# Altium project ROGO_ALFA_FULL_V2I1.PrjPcb
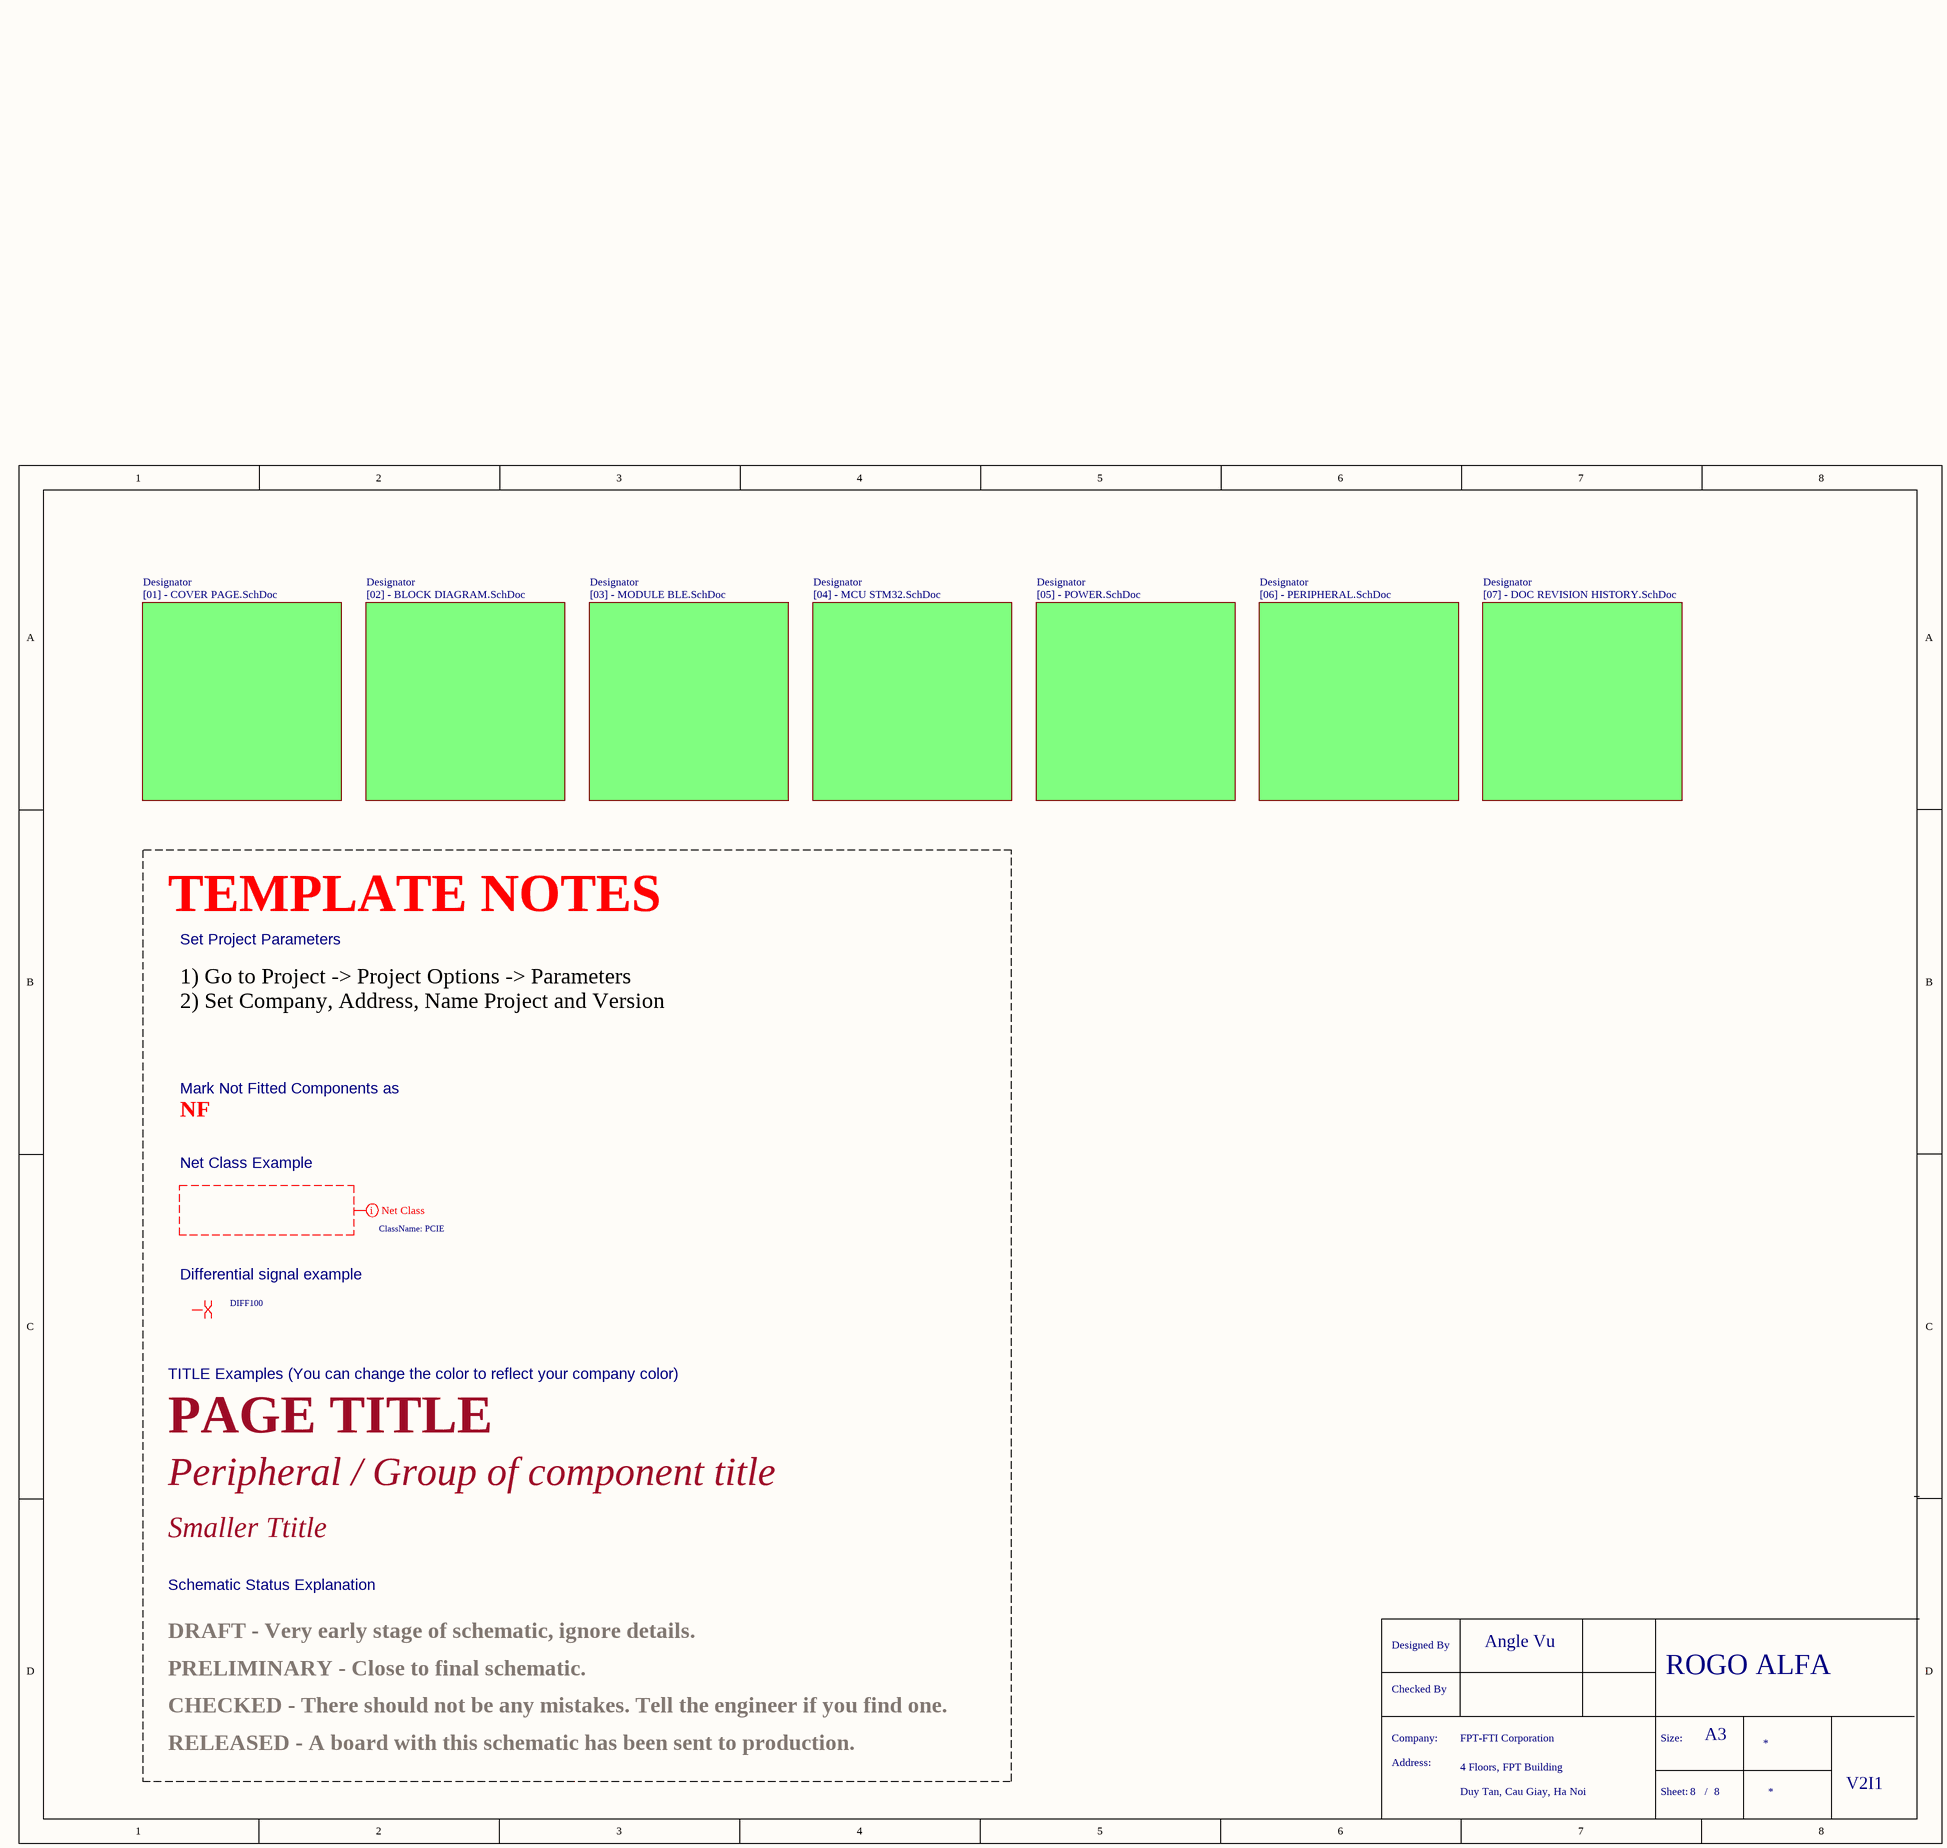
[diagram p0: ROGO ALFA FULL V2I1 Project.SchDoc]
addressName1: 4 Floors, FPT Building; addressName2: Duy Tan, Cau Giay, Ha Noi; CName: FPT-FTI Corporation; NameProject: ROGO ALFA; Version: V2I1
8 sheets, 61 parts. Net scope: flat (ports and power ports of the same name join across sheets).
Board file: ROGO_ALFA_FULL_PCB_V2I1 .PcbDoc
Sheets:
  ROGO ALFA FULL V2I1 Project.SchDoc
    Designator = [01] - COVER PAGE.SchDoc
    Designator = [02] - BLOCK DIAGRAM.SchDoc
    Designator = [03] - MODULE BLE.SchDoc
    Designator = [04] - MCU STM32.SchDoc
    Designator = [05] - POWER.SchDoc
    Designator = [06] - PERIPHERAL.SchDoc
    Designator = [07] - DOC REVISION HISTORY.SchDoc

## Sheet ROGO ALFA FULL V2I1 Project.SchDoc
size A3; CompanyName: KDS; Organization: KDS; DocumentNumber: 8; Revision: V1I1; SheetNumber: 8; SheetTotal: 8; PageSetup: Record=PageOptions|CenterHorizontal=True|CenterVertical=True|PrintScale=1.07|XCorrection=1.00|YCorrection=1.00|PrintKind=1|BorderSize=5000000|LeftOffset=0|BottomOffset=0|Orientation=2|PaperLength=1000|PaperWidth=1000|Scale=100|PaperSource=7|PrintQuality=600|MediaType=1|DitherType=10|PaperKind=A3|PrintScaleMode=1; NameAuthor: Angle Vu; ProjectName: KDS C6A816x Module

### Sub-sheets
Designator = [01] - COVER PAGE.SchDoc: no entries
Designator = [02] - BLOCK DIAGRAM.SchDoc: no entries
Designator = [03] - MODULE BLE.SchDoc: no entries
Designator = [04] - MCU STM32.SchDoc: no entries
Designator = [05] - POWER.SchDoc: no entries
Designator = [06] - PERIPHERAL.SchDoc: no entries
Designator = [07] - DOC REVISION HISTORY.SchDoc: no entries

### Layout directives
net class PCIE: (no net found under the mark)
differential pair; net class DIFF100: (no net found under the mark)

### Notes on the sheet
- TEMPLATE NOTES
- Set Project Parameters
- 1) Go to Project -> Project Options -> Parameters
  2) Set Company, Address, Name Project and Version
- NF
- Mark Not Fitted Components as
- Net Class Example
- Differential signal example
- TITLE Examples (You can change the color to reflect your company color)
- PAGE TITLE
- Peripheral / Group of component title
- Smaller Ttitle
- Schematic Status Explanation
- PRELIMINARY - Close to final schematic.
- DRAFT - Very early stage of schematic, ignore details.
- CHECKED - There should not be any mistakes. Tell the engineer if you find one.
- RELEASED - A board with this schematic has been sent to production.
- Designed By
- Checked By
- Company:
- Size:
- A3
- Address:
- Sheet:
- /

## Sheet [01] - COVER PAGE.SchDoc
size A3; DocumentNumber: 1; SheetNumber: 1; SheetTotal: 8; NameAuthor: Angle Vu
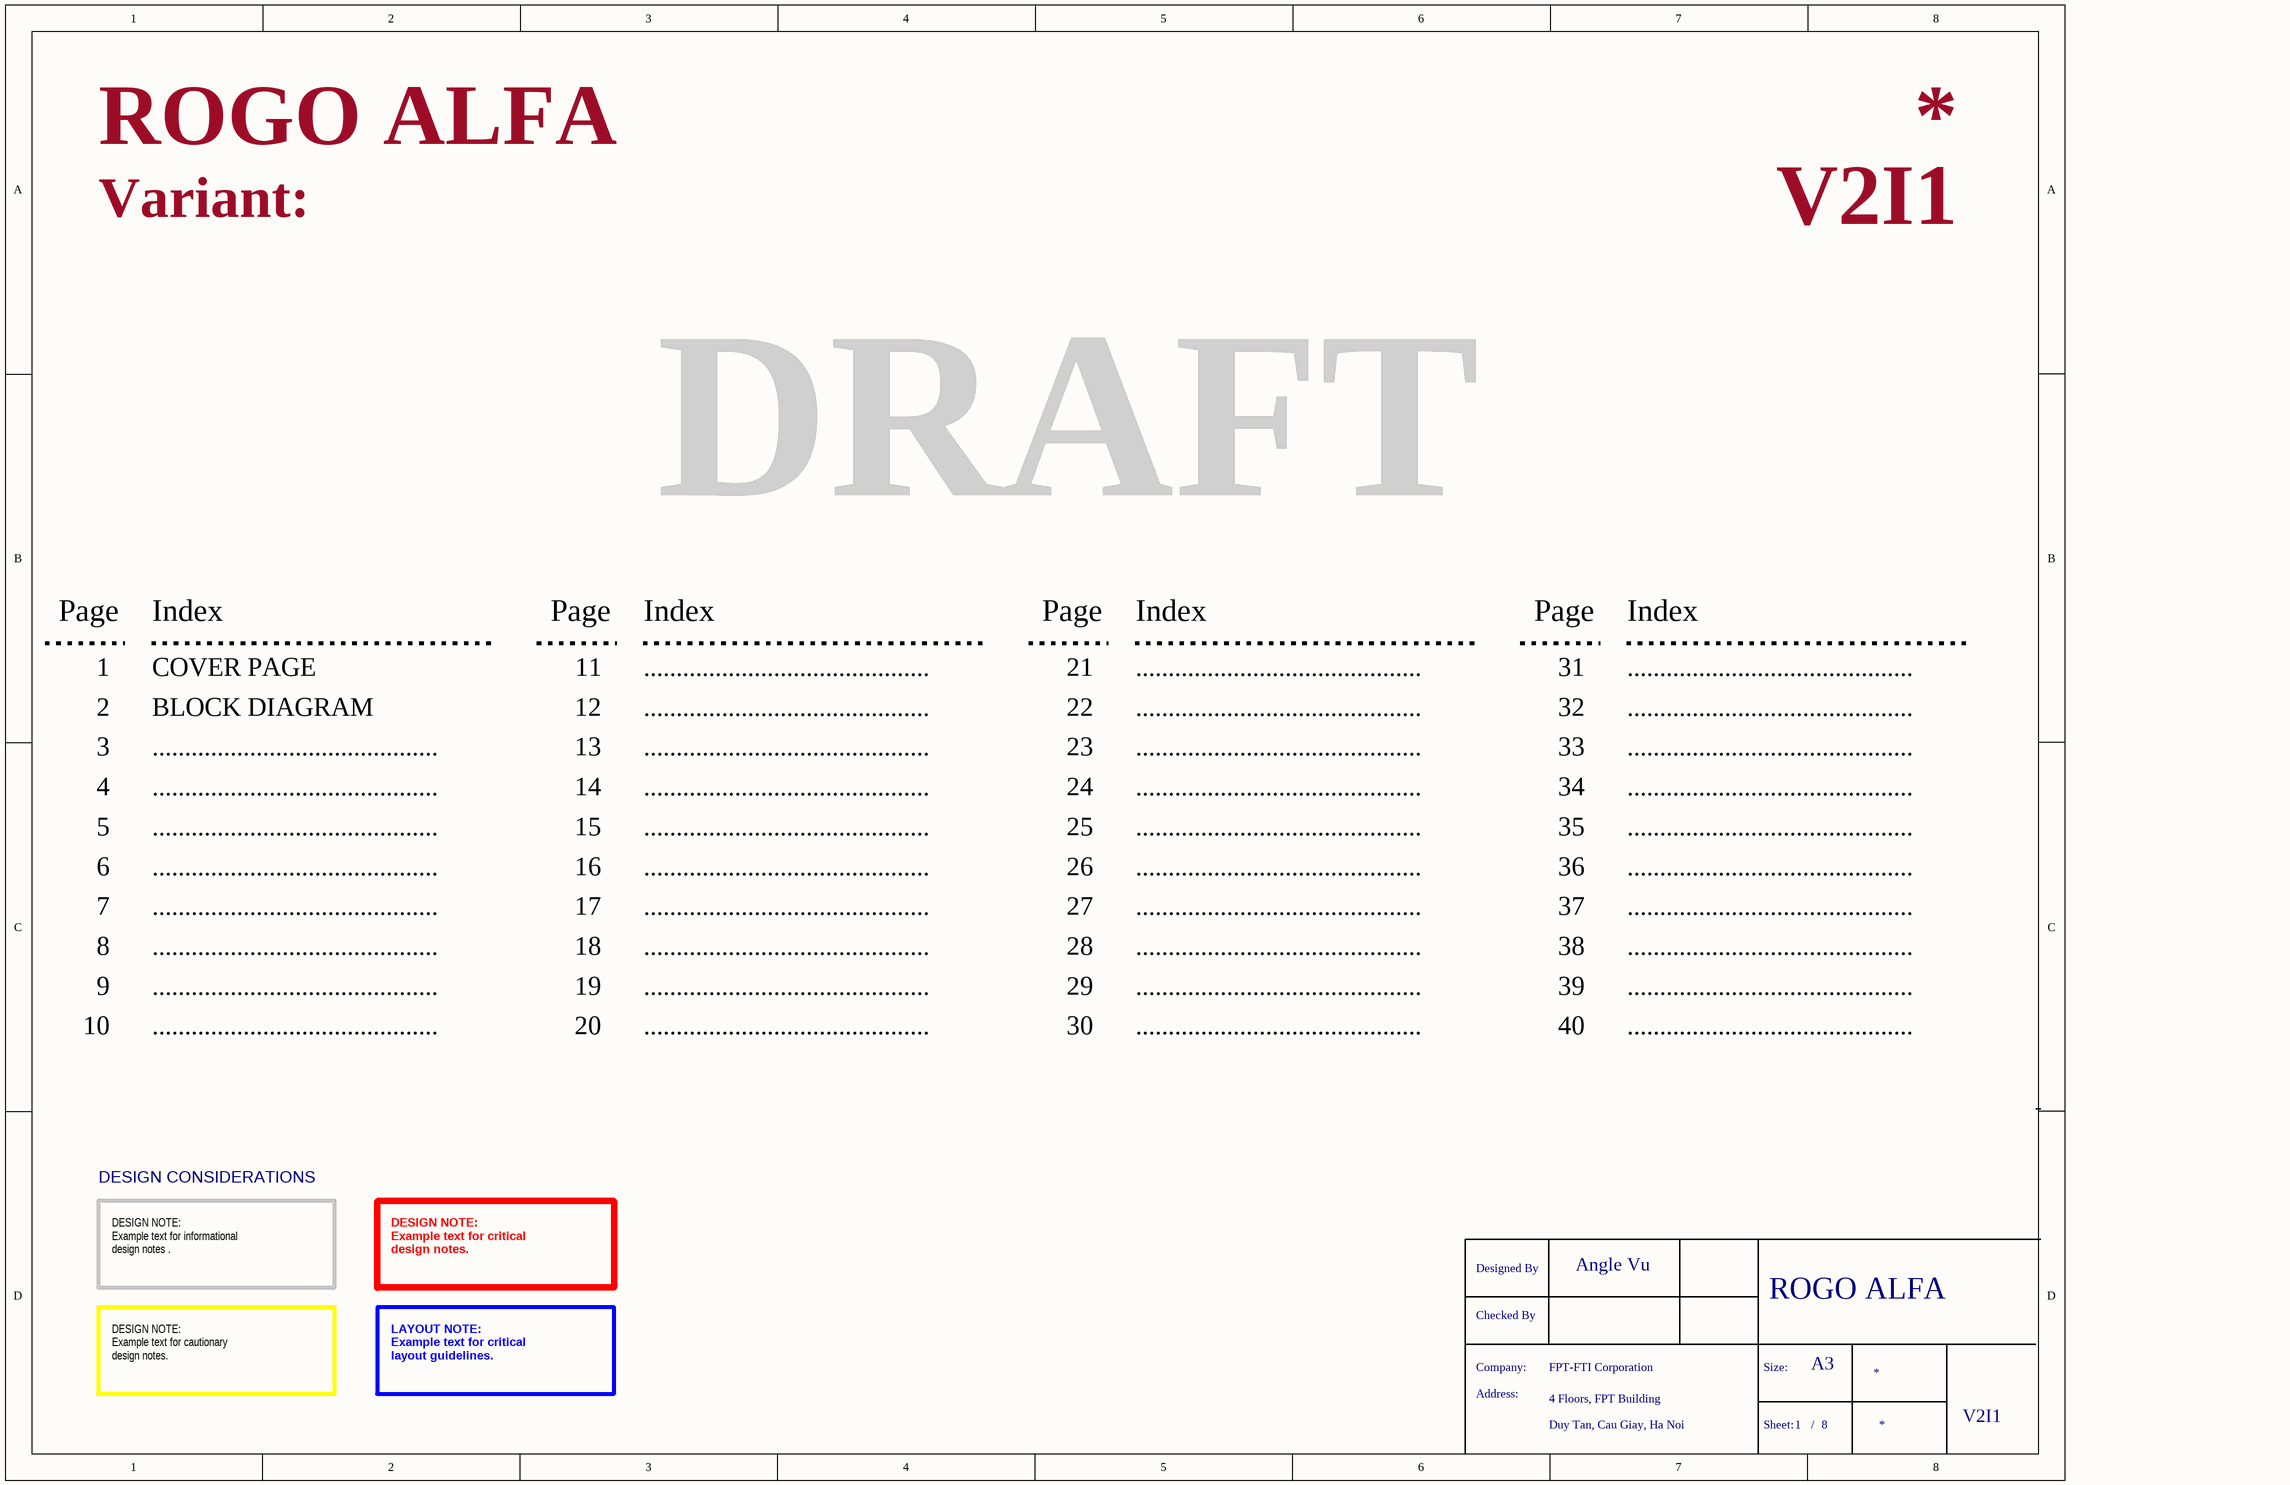
[diagram p1: [01] - COVER PAGE.SchDoc]

### Notes on the sheet
- Variant:
- DRAFT
- Page
- Index
- 1
- COVER PAGE
- 11
- ............................................
- 21
- 31
- 2
- 3
- BLOCK DIAGRAM
- 12
- 13
- 22
- 23
- 32
- 33
- 4
- 5
- 14
- 15
- 24
- 25
- 34
- 35
- 6
- 16
- 26
- 36
- 7
- 8
- 17
- 18
- 27
- 28
- 37
- 38
- 9
- 10
- 19
- 20
- 29
- 30
- 39
- 40
- DESIGN CONSIDERATIONS
- DESIGN NOTE:
  Example text for informational
  design notes .
- DESIGN NOTE:
  Example text for critical
  design notes.
- DESIGN NOTE:
  Example text for cautionary
  design notes.
- LAYOUT NOTE:
  Example text for critical
  layout guidelines.
- Designed By
- Checked By
- Company:
- Size:
- A3
- Address:
- Sheet:
- /

## Sheet [02] - BLOCK DIAGRAM.SchDoc
size A3; DocumentNumber: 2; SheetNumber: 2; SheetTotal: 8; NameAuthor: Angle Vu
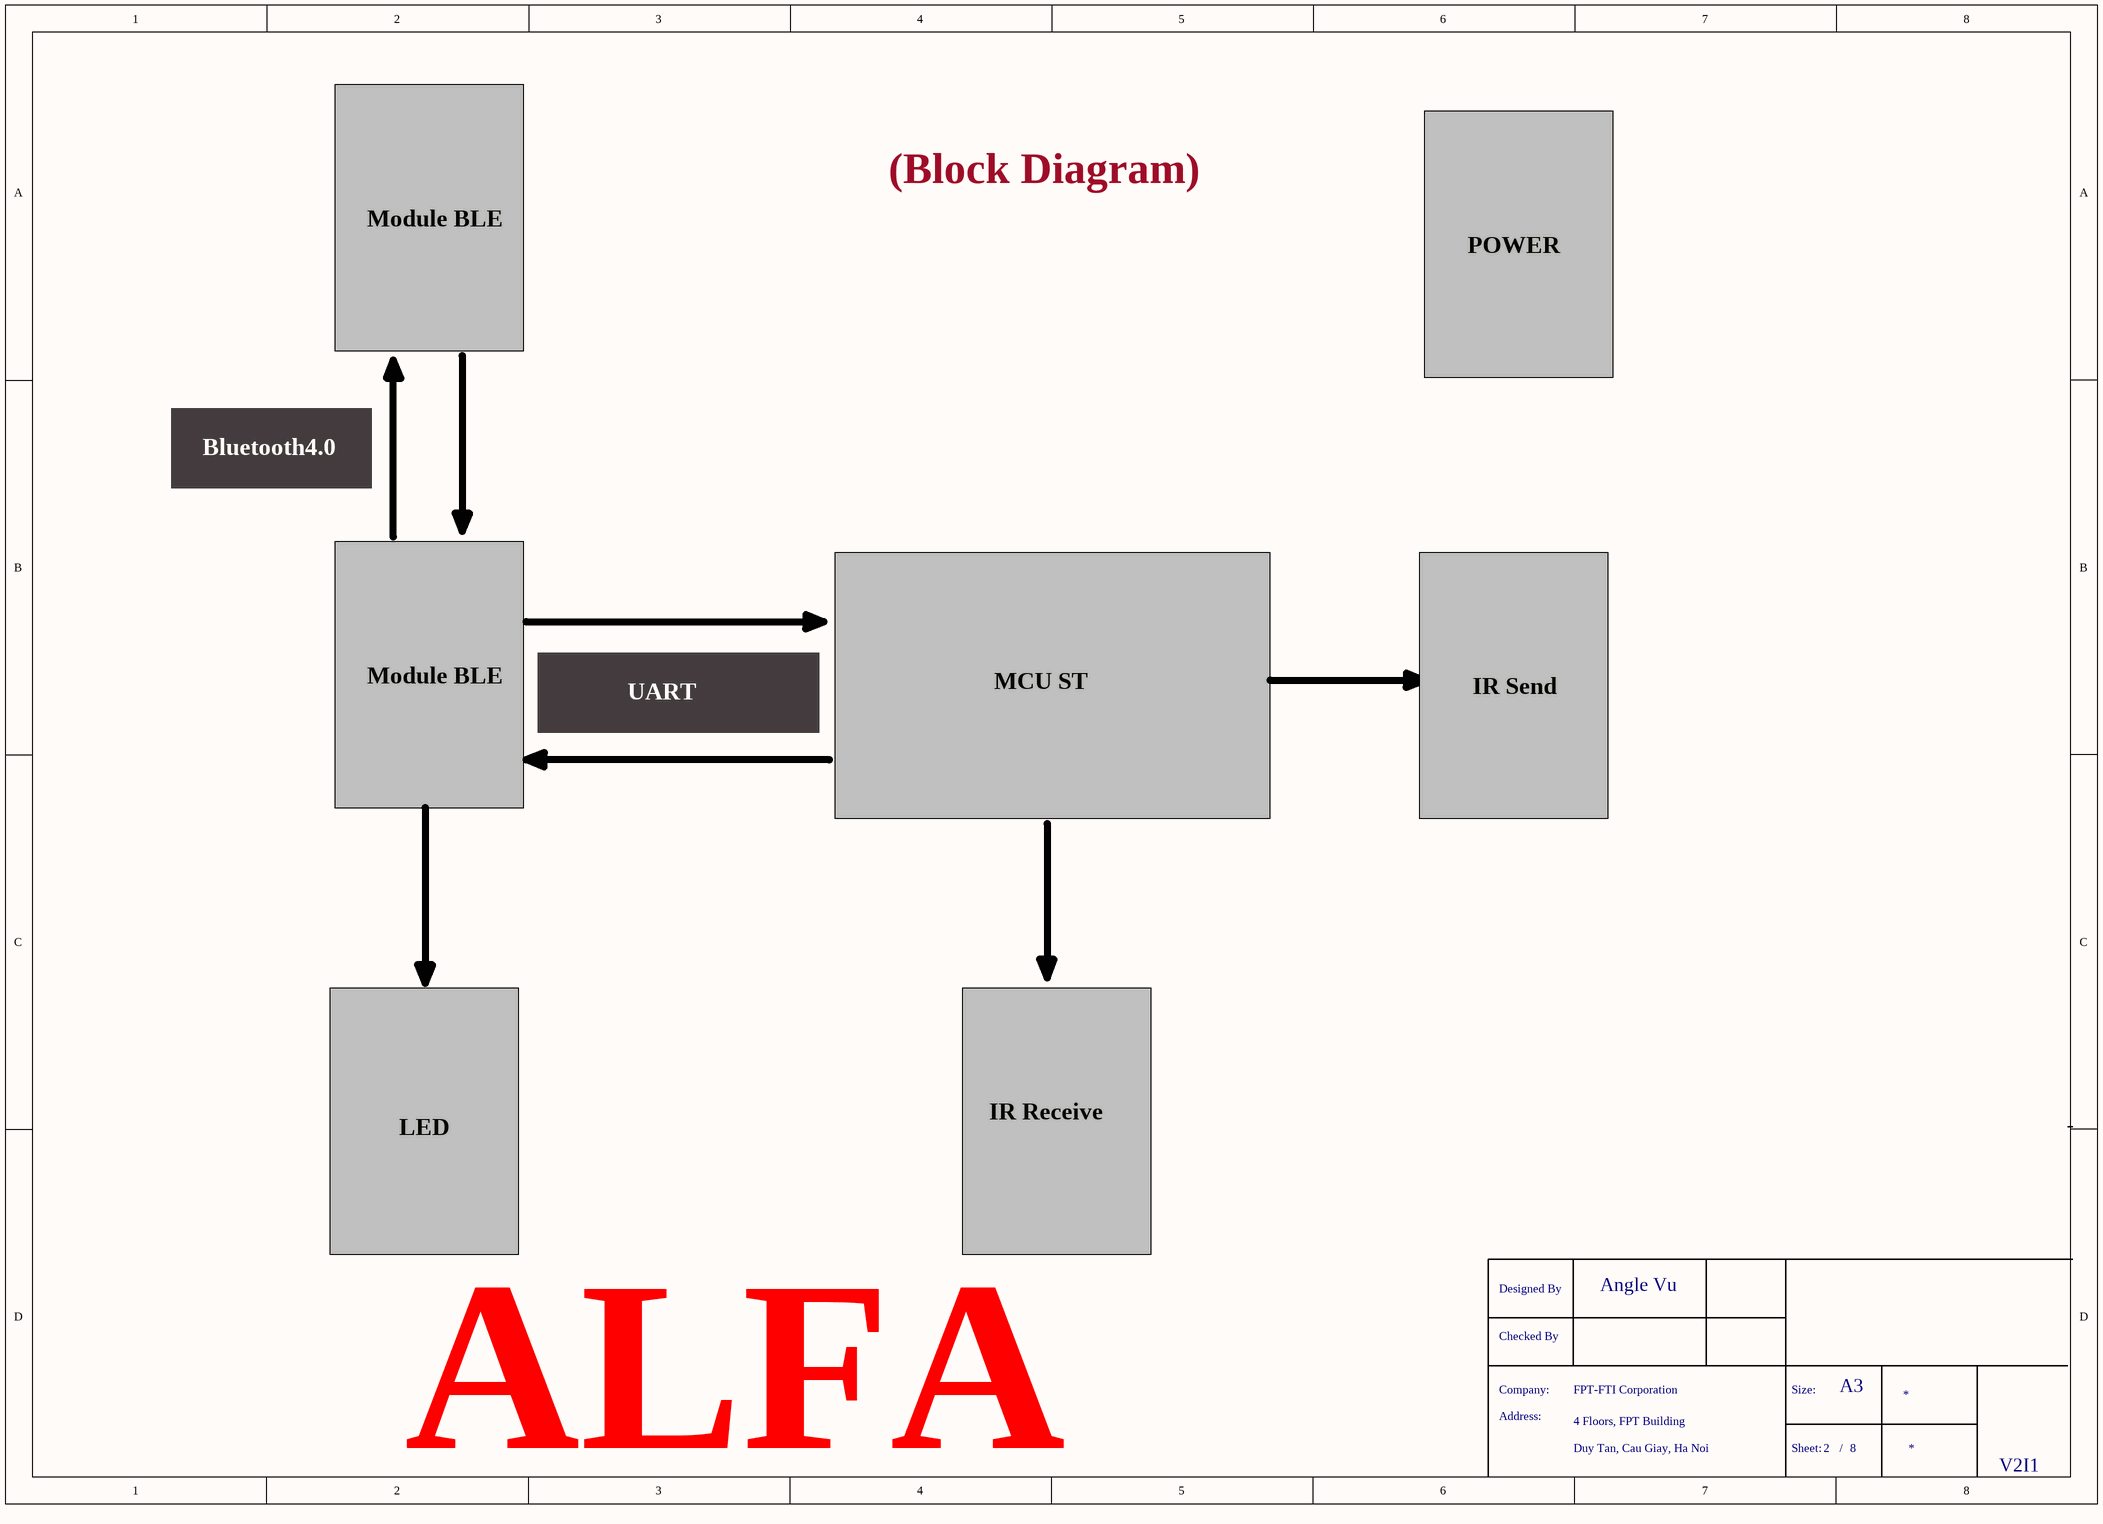
[diagram p2: [02] - BLOCK DIAGRAM.SchDoc]

### Notes on the sheet
- Module BLE
- (Block Diagram)
- POWER
- Bluetooth4.0
- UART
- MCU ST
- IR Send
- IR Receive
- LED
- CLOCKS (CPU & PCIE)
- ALFA
- Designed By
- Checked By
- Company:
- Size:
- A3
- Address:
- Sheet:
- /

## Sheet [03] - MODULE BLE.SchDoc
size A3; CompanyName: FPT-FTI copporation; Address1: FPT Building Duy Tan; Address2: Floor 4,; DocumentNumber: 3; SheetNumber: 3; SheetTotal: 8; NameAuthor: Angle Vu
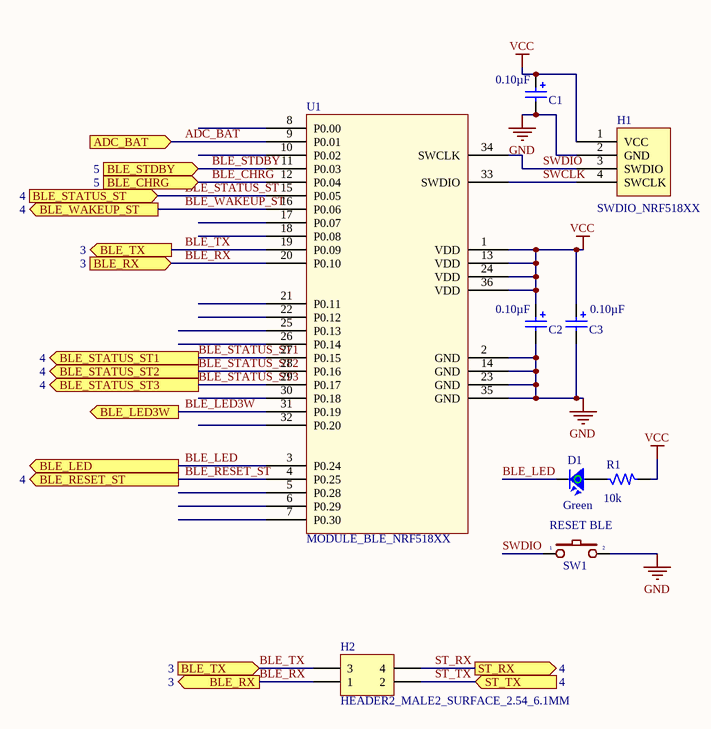
[diagram p3: [03] - MODULE BLE.SchDoc]

### Parts
C1  Capacitance: 0.10µF  [CAP_SMD0603]  (hidden comment: C_104_0603_CERAMIC_16V)
C2  Capacitance: 0.10µF  [CAP_SMD0603]  (hidden comment: C_104_0603_CERAMIC_16V)
C3  Capacitance: 0.10µF  [CAP_SMD0603]  (hidden comment: C_104_0603_CERAMIC_16V)
D1  Color: Green  [LED_GREEN_SMD0603]  (hidden comment: LED2_GREEN_0603_2V)
H1  SWDIO_NRF518XX  [HEADER4_ISP_NRF518xx_SUR1.27]
H2  HEADER2_MALE2_SURFACE_2.54_6.1MM  [HEADER2_MALE2_SUR2.54]
R1  Resistance (Ohms): 10k  [RES_SMD0603]  (hidden comment: R_10K_SMD0603_1%_1/10W)
SW1  RESET BLE  [SW2-SMD]
U1  MODULE_BLE_NRF518XX  [MODULE_NRF518xx]

### Ports
ADC_BAT (in), BLE_CHRG (in, see 5), BLE_LED3W (out), BLE_LED (out), BLE_RESET_ST (out, see 4), BLE_RX (in, see 3), BLE_RX (out, see 3), BLE_STATUS_ST1 (out, see 4), BLE_STATUS_ST2 (out, see 4), BLE_STATUS_ST3 (out, see 4), BLE_STATUS_ST (in, see 4), BLE_STDBY (in, see 5), BLE_TX (in, see 3), BLE_TX (out, see 3), BLE_WAKEUP_ST (out, see 4), ST_RX (out, see 4), ST_TX (in, see 4)

### Nets
GND: C1.2 C2.2 C3.2 H1.2(GND) SW1.2 U1.2(GND) U1.14(GND) U1.23(GND) U1.35(GND)
VCC: C1.1 C2.1 C3.1 H1.1(VCC) R1.2 U1.1(VDD) U1.13(VDD) U1.24(VDD) U1.36(VDD)
ADC_BAT: U1.9(P0.01) ; port ADC_BAT
BLE_CHRG: U1.12(P0.04) ; port BLE_CHRG
BLE_LED: D1.2 U1.3(P0.24) ; port BLE_LED
BLE_LED3W: U1.31(P0.19) ; port BLE_LED3W
BLE_RESET_ST: U1.4(P0.25) ; port BLE_RESET_ST
BLE_RX: H2.1 U1.20(P0.10) ; port BLE_RX
BLE_STATUS_ST: U1.15(P0.05) ; port BLE_STATUS_ST
BLE_STATUS_ST1: U1.27(P0.15) ; port BLE_STATUS_ST1
BLE_STATUS_ST2: U1.28(P0.16) ; port BLE_STATUS_ST2
BLE_STATUS_ST3: U1.29(P0.17) ; port BLE_STATUS_ST3
BLE_STDBY: U1.11(P0.03) ; port BLE_STDBY
BLE_TX: H2.3 U1.19(P0.09) ; port BLE_TX
BLE_WAKEUP_ST: U1.16(P0.06) ; port BLE_WAKEUP_ST
ST_RX: H2.4 ; port ST_RX
ST_TX: H2.2 ; port ST_TX
SWCLK: H1.4(SWCLK) U1.33(SWDIO)
SWDIO: H1.3(SWDIO) SW1.1 U1.34(SWCLK)
NetD1_1: D1.1 R1.1

Not connected (* = marked no-connect by the designer): U1 5(P0.28) 6(P0.29) 7(P0.30) 8(P0.00) 10(P0.02) 17(P0.07) 18(P0.08) 21(P0.11) 22(P0.12) 25(P0.13) 26(P0.14) 30(P0.18) 32(P0.20)

### Notes on the sheet
- Designed By
- Checked By
- Company:
- Size:
- A3
- Address:
- Sheet:
- /

### Library data of the parts
C1-C3 = C_104_0603_CERAMIC_16V: CAP CER 0.1UF 16V X7R 0603; Manufacturer: Murata Electronics North America; Manufacturer Part Number: GRM188R71C104KA01D; Tolerance: ±10%; Supplier 1: Digi-Key; RoHS: RoHS Compliant; Category: Capacitors; Stock 1: 3132000; Pricing 1: 4000=0.00359, 8000=0.00328, 12000=0.00312, 28000=0.00296, 100000=0.00215 (USD); Packaging: Tape & Reel (TR); Part Status: Active; Voltage - Rated: 16V; Temperature Coefficient: X7R; Mounting Type: Surface Mount, MLCC; Operating Temperature: -55°C ~ 125°C; Applications: General Purpose; Ratings: -; Package / Case: 0603 (1608 Metric); Size / Dimension: 0.063" L x 0.031" W (1.60mm x 0.80mm); Height - Seated (Max): -; Thickness (Max): 0.035" (0.90mm); Lead Spacing: -; Features: -; Lead Style: -; ComponentLink1URL: http://www.murata.com/~/media/webrenewal/support/library/catalog/products/capacitor/mlcc/c02e.pdf; ComponentLink1Description: http://www.murata.com/~/media/webrenewal/support/library/catalog/products/capacitor/mlcc/c02e.pdf; Supplier Part Number 1: 490-1532-2-ND
D1 = LED2_GREEN_0603_2V: LED GREEN CLEAR 0603 SMD; Manufacturer: Lite-On Inc.; Manufacturer Part Number: LTST-C191KGKT; Lens Color: Colorless; Millicandela Rating: 35mcd; Lens Style/Size: Rectangle with Flat Top, 1.10mm x 0.80mm; Voltage - Forward (Vf) (Typ): 2V; Current - Test: 20mA; Viewing Angle: 130°; Wavelength - Dominant: 571nm; Wavelength - Peak: 574nm; Supplier 1: Digi-Key; RoHS: RoHS Compliant; Category: Optoelectronics; Stock 1: 960000; Pricing 1: 5000=0.0404, 10000=0.03636, 25000=0.03232, 50000=0.02929, 125000=0.02727 (USD); Packaging: Tape & Reel (TR); Part Status: Active; Lens Transparency: Clear; Mounting Type: Surface Mount; Features: -; Package / Case: 0603 (1608 Metric); Supplier Device Package: *; Size / Dimension: 1.60mm L x 0.80mm W; Height (Max): 0.55mm; ComponentLink1URL: http://optoelectronics.liteon.com/upload/download/DS22-2000-228/S_110_LTST-C191KGKT.pdf; ComponentLink1Description: http://optoelectronics.liteon.com/upload/download/DS22-2000-228/S_110_LTST-C191KGKT.pdf; Supplier Part Number 1: 160-1446-2-ND
H1 = HEADER4_ISP_NRF518XX_HOLE_2.54: CONN HEADER 4POS .100 STR TIN; Manufacturer: Amphenol FCI; Manufacturer Part Number: 68002-404HLF; Connector Type: Header, Unshrouded; Number of Positions: 4; Number of Positions Loaded: All; Pitch: 0.100" (2.54mm); Supplier 1: Digi-Key; RoHS: RoHS Compliant; Category: Connectors, Interconnects; Stock 1: 5773; Pricing 1: 1=0.2, 10=0.186, 25=0.1588, 100=0.129, 250=0.11408, 500=0.10912, 1000=0.08928, 2500=0.08184, 5000=0.07936 (USD); Packaging: Bulk; Part Status: Active; Contact Type: Male Pin; Number of Rows: 1; Row Spacing: -; Contact Mating Length: 0.230" (5.84mm); Mounting Type: Through Hole; Termination: Solder; Fastening Type: -; Features: -; Contact Finish: Tin; Contact Finish Thickness: 100µin (2.54µm); Color: Black; ComponentLink1URL: http://portal.fciconnect.com/Comergent//fci/drawing/68000.pdf; ComponentLink1Description: http://portal.fciconnect.com/Comergent//fci/drawing/68000.pdf; Supplier Part Number 1: 609-3305-ND
H2 = HEADER2_MALE2_SURFACE_2.54_6.1MM: CONN HEADER 4POS TIN SMD; Manufacturer: Molex, LLC; Manufacturer Part Number: 0015912040; Connector Type: Header, Unshrouded, Breakaway; Number of Positions: 4; Number of Positions Loaded: All; Pitch: 0.100" (2.54mm); Supplier 1: Digi-Key; RoHS: RoHS Compliant; Category: Connectors, Interconnects; Stock 1: 10914; Pricing 1: 1=0.44, 10=0.42, 25=0.3596, 50=0.3058, 100=0.2938, 250=0.2638, 500=0.2518, 1000=0.20983, 2500=0.19184 (USD); Packaging: Bulk; Part Status: Active; Contact Type: Male Pin; Number of Rows: 2; Row Spacing: 0.100" (2.54mm); Contact Mating Length: 0.240" (6.10mm); Mounting Type: Surface Mount; Termination: Solder; Fastening Type: -; Features: -; Contact Finish: Tin; Contact Finish Thickness: 150µin (3.81µm); Color: Black; ComponentLink1URL: http://www.molex.com/pdm_docs/sd/015912040_sd.pdf; ComponentLink1Description: http://www.molex.com/pdm_docs/sd/015912040_sd.pdf; Supplier Part Number 1: WM9514-ND; ComponentLink2URL: http://www.te.com/commerce/DocumentDelivery/DDEController?Action=srchrtrv&DocNm=640456&DocType=Customer+Drawing&DocLang=English; ComponentLink2Description: http://www.te.com/commerce/DocumentDelivery/DDEController?Action=srchrtrv&DocNm=640456&DocType=Customer+Drawing&DocLang=English
R1 = R_10K_SMD0603_1%_1/10W: RES SMD 10K OHM 1% 1/10W 0603; Manufacturer: Yageo; Manufacturer Part Number: RC0603FR-0710KL; Power (Watts): 0.1W, 1/10W; Temperature Coefficient: ±100ppm/°C; Capacitance: 0.10µF; Voltage - Rated: 50V; Supplier 1: Digi-Key; RoHS: RoHS Compliant; Category: Resistors; Stock 1: 10005000; Pricing 1: 5000=0.00167, 10000=0.00145, 25000=0.00128, 50000=0.00117, 125000=0.00115 (USD); Packaging: Tape & Reel (TR); Part Status: Active; Tolerance: ±1%; Composition: Thick Film; Features: Moisture Resistant; Operating Temperature: -55°C ~ 155°C; Package / Case: 0603 (1608 Metric); Supplier Device Package: 0603; Size / Dimension: 0.063" L x 0.031" W (1.60mm x 0.80mm); Height: 0.022" (0.55mm); Number of Terminations: 2; ComponentLink1URL: http://www.yageo.com/documents/recent/PYu-RC_Group_51_RoHS_L_04.pdf; ComponentLink1Description: http://www.yageo.com/documents/recent/PYu-RC_Group_51_RoHS_L_04.pdf; Supplier Part Number 1: 311-10.0KHRTR-ND; Mounting Type: Surface Mount, MLCC; Applications: General Purpose; Ratings: -; Height - Seated (Max): -; Thickness (Max): 0.037" (0.94mm); Lead Spacing: -; Lead Style: -; ComponentLink2URL: http://datasheets.avx.com/X7RDielectric.pdf; ComponentLink2Description: http://datasheets.avx.com/X7RDielectric.pdf
SW1 = SW2_DPST_SURFACE_5MM: SWITCH TACTILE SPST-NO 0.05A 12V; Manufacturer: Wurth Electronics Inc; Manufacturer Part Number: 434121050836; Switch Function: Off-Mom; Contact Rating @ Voltage: 0.05A @ 12VDC; Actuator Type: Rectangular Button; Actuator Height off PCB, from Pins: 5.00mm; Actuator Orientation: Top Actuated; Outline: 6.00mm x 3.50mm; Illumination: Non-Illuminated; Operating Force: 360gf; Actuator Material: Liquid Crystal Polymer (LCP); Switch Travel: 0.25mm; Mechanical Life: 50,000 Cycles; Supplier 1: Digi-Key; RoHS: RoHS Compliant; Category: Switches; Stock 1: 0; Pricing 1: 1500=0.27 (USD); Packaging: Tape & Reel (TR); Part Status: Active; Circuit: SPST-NO; Mounting Type: Surface Mount; Termination Style: SMD (SMT) Tab; Illumination Voltage (Nominal): -; Illumination Type, Color: -; Ingress Protection: -; Features: -; Operating Temperature: -40°C ~ 85°C; ComponentLink1URL: http://katalog.we-online.de/em/datasheet/434121050836.pdf; ComponentLink1Description: http://katalog.we-online.de/em/datasheet/434121050836.pdf; Supplier Part Number 1: 732-7049-2-ND
U1 = MODULE_BLE_NRF518XX: PACKAGE: SURFACE_1.27MM; PIN: 36

## Sheet [04] - MCU STM32.SchDoc
size A3; CompanyName: FPT-FTI copporation; Address1: FPT Building Duy Tan; Address2: Floor 4,; DocumentNumber: 4; SheetNumber: 4; SheetTotal: 8; NameAuthor: Angle Vu
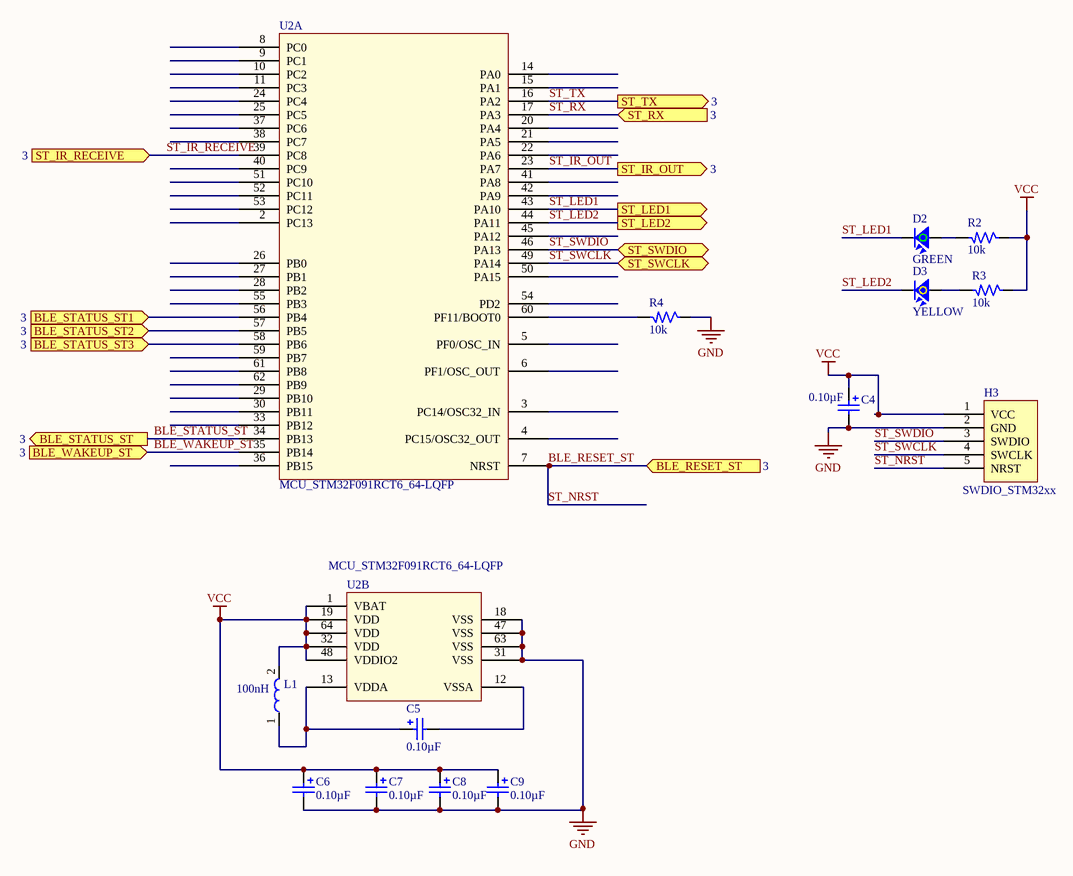
[diagram p4: [04] - MCU STM32.SchDoc]

### Parts
C4  Capacitance: 0.10µF  [CAP_SMD0603]  (hidden comment: C_104_0603_CERAMIC_16V)
C5  Capacitance: 0.10µF  [CAP_SMD0603]  (hidden comment: C_104_0603_CERAMIC_16V)
C6  Capacitance: 0.10µF  [CAP_SMD0603]  (hidden comment: C_104_0603_CERAMIC_16V)
C7  Capacitance: 0.10µF  [CAP_SMD0603]  (hidden comment: C_104_0603_CERAMIC_16V)
C8  Capacitance: 0.10µF  [CAP_SMD0603]  (hidden comment: C_104_0603_CERAMIC_16V)
C9  Capacitance: 0.10µF  [CAP_SMD0603]  (hidden comment: C_104_0603_CERAMIC_16V)
D2  GREEN  [LED_GREEN_SMD0603]
D3  YELLOW  [LED_YELLOW_SMD0603]
H3  SWDIO_STM32xx  [HEADER5_ISP_STM32F0xx_SUR1.27 - duplicate]
L1  Inductance: 100nH  [CHOKE_SMD0805]  (hidden comment: CHOKE_100NH_SMD0805)
R2  Resistance (Ohms): 10k  [RES_SMD0603]  (hidden comment: R_10K_SMD0603_1%_1/10W)
R3  Resistance (Ohms): 10k  [RES_SMD0603]  (hidden comment: R_10K_SMD0603_1%_1/10W)
R4  Resistance (Ohms): 10k  [RES_SMD0603]  (hidden comment: R_10K_SMD0603_1%_1/10W)
U2  MCU_STM32F091RCT6_64-LQFP  [MCU_STM32F091RCT6_LQFP64]  (parts A,B of 2)

### Ports
BLE_RESET_ST (in, see 3), BLE_STATUS_ST1 (in, see 3), BLE_STATUS_ST2 (in, see 3), BLE_STATUS_ST3 (in, see 3), BLE_STATUS_ST (out, see 3), BLE_WAKEUP_ST (in, see 3), ST_IR_OUT (out, see 3), ST_IR_RECEIVE (in, see 3), ST_LED1 (out), ST_LED2 (out), ST_RX (in, see 3), ST_SWCLK (bidir), ST_SWDIO (bidir), ST_TX (out, see 3)

### Nets
GND: C4.2 C6.2 C7.2 C8.2 C9.2 H3.2(GND) R4.1 U2.18(VSS) U2.31(VSS) U2.47(VSS) U2.63(VSS)
VCC: C4.1 C6.1 C7.1 C8.1 C9.1 H3.1(VCC) L1.2 R2.1 R3.1 U2.1(VBAT) U2.19(VDD) U2.32(VDD) U2.48(VDDIO2) U2.64(VDD)
BLE_RESET_ST: H3.5(NRST) U2.7(NRST) ; port BLE_RESET_ST  [also labelled ST_NRST]
BLE_STATUS_ST: U2.34(PB13) ; port BLE_STATUS_ST
BLE_STATUS_ST1: U2.56(PB4) ; port BLE_STATUS_ST1
BLE_STATUS_ST2: U2.57(PB5) ; port BLE_STATUS_ST2
BLE_STATUS_ST3: U2.58(PB6) ; port BLE_STATUS_ST3
BLE_WAKEUP_ST: U2.35(PB14) ; port BLE_WAKEUP_ST
ST_IR_OUT: U2.23(PA7) ; port ST_IR_OUT
ST_IR_RECEIVE: U2.39(PC8) ; port ST_IR_RECEIVE
ST_LED1: D2.2 U2.43(PA10) ; port ST_LED1
ST_LED2: D3.2 U2.44(PA11) ; port ST_LED2
ST_RX: U2.17(PA3) ; port ST_RX
ST_SWCLK: H3.4(SWCLK) U2.49(PA14) ; port ST_SWCLK
ST_SWDIO: H3.3(SWDIO) U2.46(PA13) ; port ST_SWDIO
ST_TX: U2.16(PA2) ; port ST_TX
NetC5_1: C5.1 L1.1 U2.13(VDDA)
NetC5_2: C5.2 U2.12(VSSA)
NetD2_1: D2.1 R2.2
NetD3_1: D3.1 R3.2
NetR4_2: R4.2 U2.60(PF11/BOOT0)

Not connected (* = marked no-connect by the designer): U2 2(PC13) 3(PC14/OSC32_IN) 4(PC15/OSC32_OUT) 5(PF0/OSC_IN) 6(PF1/OSC_OUT) 8(PC0) 9(PC1) 10(PC2) 11(PC3) 14(PA0) 15(PA1) 20(PA4) 21(PA5) 22(PA6) 24(PC4) 25(PC5) 26(PB0) 27(PB1) 28(PB2) 29(PB10) 30(PB11) 33(PB12) 36(PB15) 37(PC6) 38(PC7) 40(PC9) 41(PA8) 42(PA9) 45(PA12) 50(PA15) 51(PC10) 52(PC11) 53(PC12) 54(PD2) 55(PB3) 59(PB7) 61(PB8) 62(PB9)

### Notes on the sheet
- Designed By
- Checked By
- Company:
- Size:
- A3
- Address:
- Sheet:
- /

### Library data of the parts
C4-C9 = C_104_0603_CERAMIC_16V: as C1 on sheet [03] - MODULE BLE; Supplier 1: Digi-Key; RoHS: RoHS Compliant; Category: Capacitors; Stock 1: 3132000; Pricing 1: 4000=0.00359, 8000=0.00328, 12000=0.00312, 28000=0.00296, 100000=0.00215 (USD); Packaging: Tape & Reel (TR); Part Status: Active; Voltage - Rated: 16V; Temperature Coefficient: X7R; Mounting Type: Surface Mount, MLCC; Operating Temperature: -55°C ~ 125°C; Applications: General Purpose; Ratings: -; Package / Case: 0603 (1608 Metric); Size / Dimension: 0.063" L x 0.031" W (1.60mm x 0.80mm); Height - Seated (Max): -; Thickness (Max): 0.035" (0.90mm); Lead Spacing: -; Features: -; Lead Style: -; ComponentLink1URL: http://www.murata.com/~/media/webrenewal/support/library/catalog/products/capacitor/mlcc/c02e.pdf; ComponentLink1Description: http://www.murata.com/~/media/webrenewal/support/library/catalog/products/capacitor/mlcc/c02e.pdf; Supplier Part Number 1: 490-1532-2-ND
D2 = LED2_GREEN_0603_2V: as D1 on sheet [03] - MODULE BLE; Supplier 1: Digi-Key; RoHS: RoHS Compliant; Category: Optoelectronics; Stock 1: 960000; Pricing 1: 5000=0.0404, 10000=0.03636, 25000=0.03232, 50000=0.02929, 125000=0.02727 (USD); Packaging: Tape & Reel (TR); Part Status: Active; Color: Green; Lens Transparency: Clear; Mounting Type: Surface Mount; Features: -; Package / Case: 0603 (1608 Metric); Supplier Device Package: *; Size / Dimension: 1.60mm L x 0.80mm W; Height (Max): 0.55mm; ComponentLink1URL: http://optoelectronics.liteon.com/upload/download/DS22-2000-228/S_110_LTST-C191KGKT.pdf; ComponentLink1Description: http://optoelectronics.liteon.com/upload/download/DS22-2000-228/S_110_LTST-C191KGKT.pdf; Supplier Part Number 1: 160-1446-2-ND
D3 = LED2_YELLOW_0603_2.1V: LED YELLOW CLEAR 0603 SMD; Manufacturer: Lite-On Inc.; Manufacturer Part Number: LTST-C191KSKT; Lens Color: Colorless; Millicandela Rating: 104mcd; Lens Style/Size: Rectangle with Flat Top, 1.10mm x 0.80mm; Voltage - Forward (Vf) (Typ): 2.1V; Current - Test: 20mA; Viewing Angle: 130°; Wavelength - Dominant: 591nm; Wavelength - Peak: 588nm; Supplier 1: Digi-Key; RoHS: RoHS Compliant; Category: Optoelectronics; Stock 1: 280000; Pricing 1: 5000=0.043, 10000=0.0387, 25000=0.0344, 50000=0.03118, 125000=0.02903 (USD); Packaging: Tape & Reel (TR); Part Status: Active; Color: Yellow; Lens Transparency: Clear; Mounting Type: Surface Mount; Features: -; Package / Case: 0603 (1608 Metric); Supplier Device Package: *; Size / Dimension: 1.60mm L x 0.80mm W; Height (Max): 0.55mm; ComponentLink1URL: http://optoelectronics.liteon.com/upload/download/DS22-2000-224/S_110_LTST-C191KSKT.pdf; ComponentLink1Description: http://optoelectronics.liteon.com/upload/download/DS22-2000-224/S_110_LTST-C191KSKT.pdf; Supplier Part Number 1: 160-1448-2-ND
H3 = HEADER5_ISP_STM32xx_HOLE_2.54: CONN HEADER 5 POS 2.54; Manufacturer: Wurth Electronics Inc; Manufacturer Part Number: 61300511121; Connector Type: Header, Unshrouded; Number of Positions: 5; Number of Positions Loaded: All; Pitch: 0.100" (2.54mm); Supplier 1: Digi-Key; RoHS: RoHS Compliant; Category: Connectors, Interconnects; Stock 1: 5098; Pricing 1: 1=0.23, 100=0.2106, 500=0.1782 (USD); Packaging: Bulk; Part Status: Active; Contact Type: Male Pin; Number of Rows: 1; Row Spacing: -; Contact Mating Length: 0.236" (6.00mm); Mounting Type: Through Hole; Termination: Solder; Fastening Type: -; Features: -; Contact Finish: Gold; Contact Finish Thickness: -; Color: Black; ComponentLink1URL: http://katalog.we-online.de/em/datasheet/6130xx11121.pdf; ComponentLink1Description: http://katalog.we-online.de/em/datasheet/6130xx11121.pdf; Supplier Part Number 1: 732-5318-ND
L1 = CHOKE_100NH_SMD0805: FIXED IND 100NH 300MA 900 MOHM; Manufacturer: Jaro Components Inc.; Manufacturer Part Number: HFI-201209-R10J; Type: Wirewound; Material - Core: Ceramic; Tolerance: ±5%; Shielding: Unshielded; DC Resistance (DCR): 900 mOhm Max; Q @ Freq: 18 @ 100MHz; Frequency - Self Resonant: 600MHz; Frequency - Test: 100MHz; Supplier 1: Digi-Key; RoHS: Request Inventory Verification; Category: Inductors, Coils, Chokes; Stock 1: 513; Pricing 1: 1=0.11, 10=0.107, 25=0.1052, 250=0.10312, 500=0.10106 (USD); Packaging: Cut Tape (CT); Part Status: Discontinued; Current Rating: 300mA; Current - Saturation: -; Ratings: -; Operating Temperature: -; Mounting Type: Surface Mount; Package / Case: 0805 (2012 Metric); Size / Dimension: 0.079" L x 0.049" W (2.00mm x 1.25mm); Height - Seated (Max): 0.043" (1.10mm); ComponentLink1URL: http://www.jarocomponents.com/1043spec/InductorsChipSurfaceMount/Jaro_Ind_Chip_SM_HFI_HighFrequencyMultilayer.pdf; ComponentLink1Description: http://www.jarocomponents.com/1043spec/InductorsChipSurfaceMount/Jaro_Ind_Chip_SM_HFI_HighFrequencyMultilayer.pdf; Supplier Part Number 1: 334-1072-1-ND
R2-R4 = R_10K_SMD0603_1%_1/10W: as R1 on sheet [03] - MODULE BLE; Supplier 1: Digi-Key; RoHS: RoHS Compliant; Category: Resistors; Stock 1: 10005000; Pricing 1: 5000=0.00167, 10000=0.00145, 25000=0.00128, 50000=0.00117, 125000=0.00115 (USD); Packaging: Tape & Reel (TR); Part Status: Active; Tolerance: ±1%; Composition: Thick Film; Features: Moisture Resistant; Operating Temperature: -55°C ~ 155°C; Package / Case: 0603 (1608 Metric); Supplier Device Package: 0603; Size / Dimension: 0.063" L x 0.031" W (1.60mm x 0.80mm); Height: 0.022" (0.55mm); Number of Terminations: 2; ComponentLink1URL: http://www.yageo.com/documents/recent/PYu-RC_Group_51_RoHS_L_04.pdf; ComponentLink1Description: http://www.yageo.com/documents/recent/PYu-RC_Group_51_RoHS_L_04.pdf; Supplier Part Number 1: 311-10.0KHRTR-ND; Mounting Type: Surface Mount, MLCC; Applications: General Purpose; Ratings: -; Height - Seated (Max): -; Thickness (Max): 0.037" (0.94mm); Lead Spacing: -; Lead Style: -; ComponentLink2URL: http://datasheets.avx.com/X7RDielectric.pdf; ComponentLink2Description: http://datasheets.avx.com/X7RDielectric.pdf
U2 = MCU_STM32F091RCT6_64-LQFP: IC MCU 32BIT 256KB FLASH 64LQFP; Manufacturer: STMicroelectronics; Core Processor: ARM® Cortex®-M0; Core Size: 32-Bit; Speed: 48MHz; Connectivity: CAN, I²C, IrDA, LIN, SPI, UART/USART; Peripherals: DMA, I²S, POR, PWM, WDT; Number of I/O: 52; Program Memory Size: 256KB (256K x 8); RAM Size: 32K x 8; Voltage - Supply (Vcc/Vdd): 2 V ~ 3.6 V; Data Converters: A/D 19x12b, D/A 2x12b; Oscillator Type: Internal; Supplier 1: Digi-Key; Manufacturer Part Number: STM32F091RCT6; RoHS: RoHS Compliant; Category: Integrated Circuits (ICs); Stock 1: 0; Pricing 1: 1=4.47, 10=4.013, 100=3.2877, 500=2.79876, 1000=2.3604 (USD); Packaging: Tray; Part Status: Active; Program Memory Type: FLASH; EEPROM Size: -; Operating Temperature: -40°C ~ 85°C (TA); Package / Case: 64-LQFP; Supplier Device Package: 64-LQFP (10x10); ComponentLink1URL: http://www.st.com/web/en/resource/technical/document/datasheet/DM00115237.pdf; ComponentLink1Description: http://www.st.com/web/en/resource/technical/document/datasheet/DM00115237.pdf; Supplier Part Number 1: 497-15167-ND

## Sheet [05] - POWER.SchDoc
size A3; CompanyName: FPT-FTI copporation; Address1: FPT Building Duy Tan; Address2: Floor 4,; DocumentNumber: 5; SheetNumber: 5; SheetTotal: 8; NameAuthor: Angle Vu
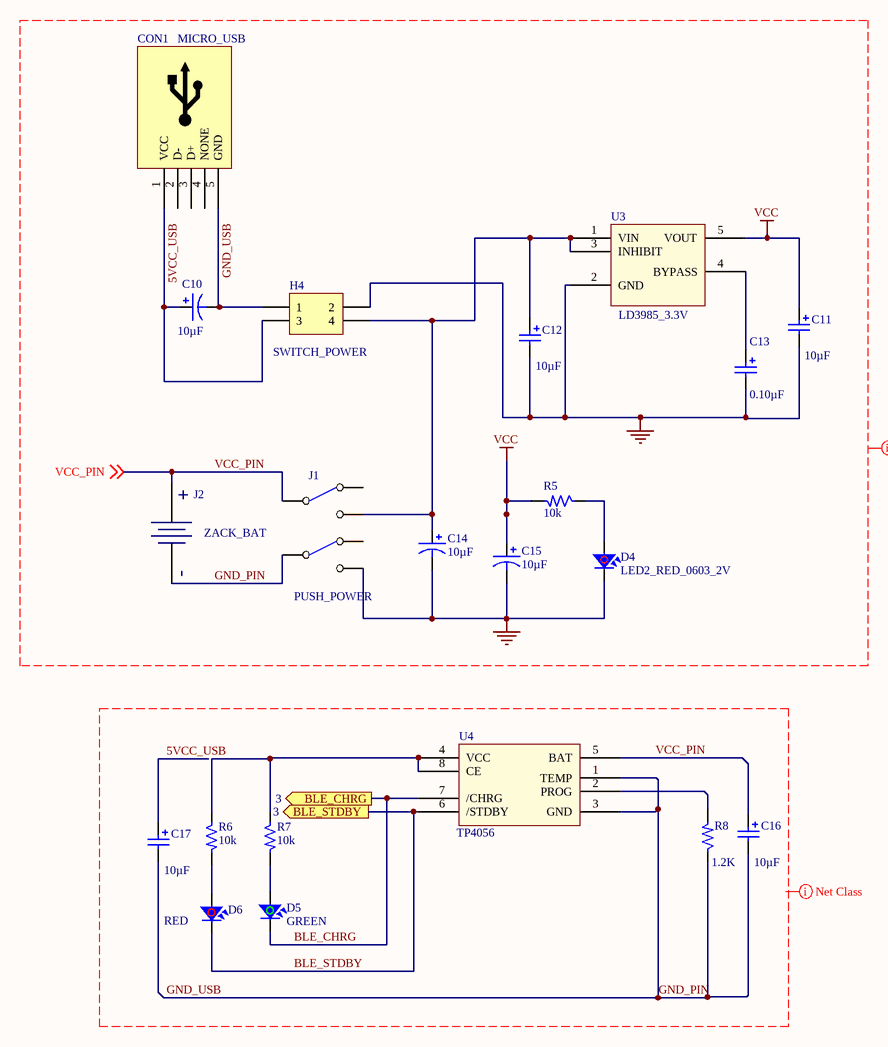
[diagram p5: [05] - POWER.SchDoc]

### Parts
C10  Capacitance: 10µF  [CAP_SMD0805 - TANTALUM]  (hidden comment: C_106_0805_TANTALUM_16V)
C11  Capacitance: 10µF  [CAP_SMD0805]  (hidden comment: C_106_0805_CERAMIC_16V)
C12  Capacitance: 10µF  [CAP_SMD0805]  (hidden comment: C_106_0805_CERAMIC_16V)
C13  Capacitance: 0.10µF  [CAP_SMD0603]  (hidden comment: C_104_0603_CERAMIC_16V)
C14  Capacitance: 10µF  [CAP_SMD0805 - TANTALUM]  (hidden comment: C_106_0805_TANTALUM_16V)
C15  Capacitance: 10µF  [CAP_SMD0805 - TANTALUM]  (hidden comment: C_106_0805_TANTALUM_16V)
C16  Capacitance: 10µF  [CAP_SMD0805]  (hidden comment: C_106_0805_CERAMIC_16V)
C17  Capacitance: 10µF  [CAP_SMD0805]  (hidden comment: C_106_0805_CERAMIC_16V)
CON1  MICRO_USB  [CON_MICRO_USB_HOLE]
D4  LED2_RED_0603_2V  [LED_RED_SMD0603]
D5  GREEN  [LED_GREEN_SMD0603]
D6  RED  [LED_RED_SMD0603]
H4  SWITCH_POWER  [HEADER2_MALE2_HOLE2.54]
J1  PUSH_POWER  [SW6_DPDT_POWER]
J2  ZACK_BAT  [ZACK_BAT]
R5  Resistance (Ohms): 10k  [RES_SMD0603]  (hidden comment: R_10K_SMD0603_1%_1/10W)
R6  Resistance (Ohms): 10k  [RES_SMD0603]  (hidden comment: R_10K_SMD0603_1%_1/10W)
R7  Resistance (Ohms): 10k  [RES_SMD0603]  (hidden comment: R_10K_SMD0603_1%_1/10W)
R8  Resistance (Ohms): 1.2K  [RES_SMD0603]  (hidden comment: R_1K2_SMD0603_1%_1/10W)
U3  LD3985_3.3V  [POWER_LDO_LDR3985-3.3]
U4  TP4056  [POWER__CHARGE_TP4056]

### Ports
BLE_CHRG (out, see 3), BLE_STDBY (out, see 3)

### Nets
GND: C11.2 C12.2 C13.2 C14.2 C15.2 D4.2 H4.2 J1.4(NO) U3.2(GND)
VCC: C11.1 C15.1 R5.2 U3.5(VOUT)
VCC_PIN: C16.1 J1.2(COMMON) J2.1(+) U4.5(BAT) ; off-sheet VCC_PIN
5VCC_USB: C10.1 C17.1 CON1.1(VCC) H4.3
BLE_CHRG: D5.2 U4.7(/CHRG) ; port BLE_CHRG
BLE_STDBY: D6.2 U4.6(/STDBY) ; port BLE_STDBY
GND_PIN: C10.2 C16.2 C17.2 CON1.5(GND) H4.1 J1.5(COMMON) J2.2(-) R8.1 U4.1(TEMP) U4.3(GND)  [also labelled GND_USB]
NetC12_1: C12.1 C14.1 H4.4 J1.3(NO) U3.1(VIN) U3.3(INHIBIT)
NetC13_1: C13.1 U3.4(BYPASS)
NetD4_1: D4.1 R5.1
NetD5_1: D5.1 R7.2
NetD6_1: D6.1 R6.2
NetR6_1: R6.1 R7.1 U4.4(VCC) U4.8(CE)
NetR8_2: R8.2 U4.2(PROG)

Not connected (* = marked no-connect by the designer): CON1 2(D-) 3(D+) 4(NONE); J1 1(NC) 6(NC)

### Layout directives
power charge: Undefined: 5VCC_USB, BLE_CHRG, BLE_STDBY, GND_PIN, GND_USB, VCC_PIN
power supply: Undefined: 5VCC_USB, GND, GND_PIN, GND_USB, VCC, VCC_PIN

### Notes on the sheet
- Designed By
- Checked By
- Company:
- Size:
- A3
- Address:
- Sheet:
- /

### Library data of the parts
C10 C14 C15 = C_106_0805_TANTALUM_16V: CAP TANT 10UF 16V 10% 0805; Manufacturer: AVX Corporation; Manufacturer Part Number: TPCR106K016R1800; Manufacturer Size Code: R; ESR (Equivalent Series Resistance): 1.8 Ohm; Type: Molded; Supplier 1: Digi-Key; RoHS: RoHS Compliant; Category: Capacitors; Stock 1: 7500; Pricing 1: 2500=1.404, 5000=1.377, 12500=1.3392, 25000=1.323, 62500=1.296 (USD); Packaging: Tape & Reel (TR); Part Status: Active; Tolerance: ±10%; Voltage - Rated: 16V; Operating Temperature: -55°C ~ 125°C; Mounting Type: Surface Mount; Package / Case: 0805 (2012 Metric); Size / Dimension: 0.079" L x 0.053" W (2.00mm x 1.35mm); Height - Seated (Max): 0.059" (1.50mm); Lead Spacing: -; Features: General Purpose; Lifetime @ Temp.: -; ComponentLink1URL: http://datasheets.avx.com/TPC.pdf; ComponentLink1Description: http://datasheets.avx.com/TPC.pdf; Supplier Part Number 1: 478-9014-2-ND
C11 C12 C16 C17 = C_106_0805_CERAMIC_16V: CAP CER 10UF 16V X5R 0805; Manufacturer: Murata Electronics North America; Manufacturer Part Number: GRM21BR61C106KE15K; Tolerance: ±10%; Supplier 1: Digi-Key; RoHS: RoHS Compliant; Category: Capacitors; Stock 1: 106329; Pricing 1: 1=0.19, 10=0.13, 50=0.0748, 100=0.0618, 250=0.052, 500=0.04356, 1000=0.03575, 5000=0.03023 (USD); Packaging: Cut Tape (CT); Part Status: Active; Voltage - Rated: 16V; Temperature Coefficient: X5R; Mounting Type: Surface Mount, MLCC; Operating Temperature: -55°C ~ 85°C; Applications: General Purpose; Ratings: -; Package / Case: 0805 (2012 Metric); Size / Dimension: 0.079" L x 0.049" W (2.00mm x 1.25mm); Height - Seated (Max): -; Thickness (Max): 0.053" (1.35mm); Lead Spacing: -; Features: -; Lead Style: -; ComponentLink1URL: http://www.murata.com/~/media/webrenewal/support/library/catalog/products/capacitor/mlcc/c02e.pdf; ComponentLink1Description: http://www.murata.com/~/media/webrenewal/support/library/catalog/products/capacitor/mlcc/c02e.pdf; Supplier Part Number 1: 490-6473-1-ND
C13 = C_104_0603_CERAMIC_16V: as C1 on sheet [03] - MODULE BLE; Supplier 1: Digi-Key; RoHS: RoHS Compliant; Category: Capacitors; Stock 1: 3132000; Pricing 1: 4000=0.00359, 8000=0.00328, 12000=0.00312, 28000=0.00296, 100000=0.00215 (USD); Packaging: Tape & Reel (TR); Part Status: Active; Voltage - Rated: 16V; Temperature Coefficient: X7R; Mounting Type: Surface Mount, MLCC; Operating Temperature: -55°C ~ 125°C; Applications: General Purpose; Ratings: -; Package / Case: 0603 (1608 Metric); Size / Dimension: 0.063" L x 0.031" W (1.60mm x 0.80mm); Height - Seated (Max): -; Thickness (Max): 0.035" (0.90mm); Lead Spacing: -; Features: -; Lead Style: -; ComponentLink1URL: http://www.murata.com/~/media/webrenewal/support/library/catalog/products/capacitor/mlcc/c02e.pdf; ComponentLink1Description: http://www.murata.com/~/media/webrenewal/support/library/catalog/products/capacitor/mlcc/c02e.pdf; Supplier Part Number 1: 490-1532-2-ND
CON1 = CONNECT_MICRO_USB_SURFACE: CONN RCPT STD MICRO USB TYPE B; Manufacturer: Amphenol FCI; Manufacturer Part Number: 10103593-0001LF; Connector Type: USB - micro B; Number of Contacts: 5; Gender: Receptacle; Specifications: USB 2.0; Regulator Topology: Positive Fixed; Voltage - Output: 3.3V; Current - Output: 150mA; Voltage - Dropout (Typical): 0.06V @ 150mA; Number of Regulators: 1; Voltage - Input: Up to 6V; Current - Limit (Min): 300mA; RoHS: RoHS Compliant; Category: Connectors, Interconnects; Packaging: Digi-Reel®; Part Status: Active; Mounting Type: Board Cutout, Surface Mount, Right Angle; Features: Shielded, Solder Retention; Ingress Protection: -; ComponentLink1URL: http://portal.fciconnect.com/Comergent//fci/drawing/10103593.pdf; ComponentLink1Description: http://portal.fciconnect.com/Comergent//fci/drawing/10103593.pdf; Operating Temperature: -40°C ~ 125°C; Package / Case: SC-74A, SOT-753; Supplier Device Package: SOT-23-5; ComponentLink2URL: http://www.st.com/web/en/resource/technical/document/datasheet/CD00003395.pdf; ComponentLink2Description: http://www.st.com/web/en/resource/technical/document/datasheet/CD00003395.pdf; Supplier 1: Digi-Key; Stock 1: 4000; Pricing 1: 1000=0.36878, 2000=0.3576, 3000=0.33525, 5000=0.32408, 10000=0.30173, 25000=0.29055 (USD); Supplier Part Number 1: 609-4049-2-ND
D4 D6 = LED2_RED_0603_2V: LED RED CLEAR 0603 SMD; Manufacturer: Lite-On Inc.; Manufacturer Part Number: LTST-C191KRKT; Lens Color: Colorless; Millicandela Rating: 54mcd; Lens Style/Size: Rectangle with Flat Top, 1.10mm x 0.80mm; Voltage - Forward (Vf) (Typ): 2V; Current - Test: 20mA; Viewing Angle: 130°; Wavelength - Dominant: 631nm; Wavelength - Peak: 639nm; Supplier 1: Digi-Key; RoHS: RoHS Compliant; Category: Optoelectronics; Stock 1: 680000; Pricing 1: 5000=0.0404, 10000=0.03636, 25000=0.03232, 50000=0.02929, 125000=0.02727 (USD); Packaging: Tape & Reel (TR); Part Status: Active; Color: Red; Lens Transparency: Clear; Mounting Type: Surface Mount; Features: -; Package / Case: 0603 (1608 Metric); Supplier Device Package: *; Size / Dimension: 1.60mm L x 0.80mm W; Height (Max): 0.55mm; ComponentLink1URL: http://optoelectronics.liteon.com/upload/download/DS22-2000-223/S_110_LTST-C191KRKT.pdf; ComponentLink1Description: http://optoelectronics.liteon.com/upload/download/DS22-2000-223/S_110_LTST-C191KRKT.pdf; Supplier Part Number 1: 160-1447-2-ND
D5 = LED2_GREEN_0603_2V: as D1 on sheet [03] - MODULE BLE; Supplier 1: Digi-Key; RoHS: RoHS Compliant; Category: Optoelectronics; Stock 1: 960000; Pricing 1: 5000=0.0404, 10000=0.03636, 25000=0.03232, 50000=0.02929, 125000=0.02727 (USD); Packaging: Tape & Reel (TR); Part Status: Active; Color: Green; Lens Transparency: Clear; Mounting Type: Surface Mount; Features: -; Package / Case: 0603 (1608 Metric); Supplier Device Package: *; Size / Dimension: 1.60mm L x 0.80mm W; Height (Max): 0.55mm; ComponentLink1URL: http://optoelectronics.liteon.com/upload/download/DS22-2000-228/S_110_LTST-C191KGKT.pdf; ComponentLink1Description: http://optoelectronics.liteon.com/upload/download/DS22-2000-228/S_110_LTST-C191KGKT.pdf; Supplier Part Number 1: 160-1446-2-ND
H4 = HEADER2_MALE2_SURFACE_2.54_6.1MM: as H2 on sheet [03] - MODULE BLE; Supplier 1: Digi-Key; RoHS: RoHS Compliant; Category: Connectors, Interconnects; Stock 1: 10914; Pricing 1: 1=0.44, 10=0.42, 25=0.3596, 50=0.3058, 100=0.2938, 250=0.2638, 500=0.2518, 1000=0.20983, 2500=0.19184 (USD); Packaging: Bulk; Part Status: Active; Contact Type: Male Pin; Number of Rows: 2; Row Spacing: 0.100" (2.54mm); Contact Mating Length: 0.240" (6.10mm); Mounting Type: Surface Mount; Termination: Solder; Fastening Type: -; Features: -; Contact Finish: Tin; Contact Finish Thickness: 150µin (3.81µm); Color: Black; ComponentLink1URL: http://www.molex.com/pdm_docs/sd/015912040_sd.pdf; ComponentLink1Description: http://www.molex.com/pdm_docs/sd/015912040_sd.pdf; Supplier Part Number 1: WM9514-ND
J1 = SW6_DPDT_HOLE_PUSH_0.1A_30A: SWITCH PUSH DPDT 0.1A 30V; Manufacturer: Apem Inc.; Manufacturer Part Number: MHPS2266; Switch Function: On-On; Current Rating: 100mA (DC); Actuator Type: Plunger for Cap; Electrical Life: 10,000 Cycles; Supplier 1: Digi-Key; RoHS: RoHS Compliant; Category: Switches; Stock 1: 2279; Pricing 1: 1=1.33, 10=1.243, 25=1.184, 50=1.1248, 100=1.0952, 250=1.0656, 500=1.0064, 1000=0.9472, 2500=0.8584 (USD); Packaging: Bulk; Part Status: Active; Type: Keyswitch; Circuit: DPDT; Voltage Rating - AC: -; Voltage Rating - DC: 30V; Color - Actuator/Cap: -; Illumination Type, Color: -; Illumination Voltage (Nominal): -; Mounting Type: Through Hole; Termination Style: PC Pin; Ingress Protection: -; Features: -; Panel Cutout Dimensions: -; Operating Temperature: -20°C ~ 65°C; Mechanical Life: -; ComponentLink1URL: http://www.apem.com/files/apem/brochures/MHPS_Q42014.pdf; ComponentLink1Description: http://www.apem.com/files/apem/brochures/MHPS_Q42014.pdf; Supplier Part Number 1: 679-3528-ND
J2 = ZACK2_HOLE_BATTERY_LOCK: CONN HEADER VERT 2POS .100 TIN; Manufacturer: TE Connectivity AMP Connectors; Manufacturer Part Number: 640456-2; Connector Type: Header, Unshrouded; Number of Positions: 2; Number of Positions Loaded: All; Pitch: 0.100" (2.54mm); Supplier 1: Digi-Key; RoHS: RoHS Compliant; Category: Connectors, Interconnects; Stock 1: 136186; Pricing 1: 1=0.12, 10=0.083, 100=0.069, 500=0.066, 1000=0.058, 2000=0.052, 5000=0.05, 10000=0.041 (USD); Packaging: Bulk; Part Status: Active; Contact Type: Male Pin; Number of Rows: 1; Row Spacing: -; Contact Mating Length: 0.295" (7.49mm); Mounting Type: Through Hole; Termination: Solder; Fastening Type: Friction Lock; Features: -; Contact Finish: Tin; Contact Finish Thickness: -; Color: Natural; ComponentLink1URL: http://www.te.com/commerce/DocumentDelivery/DDEController?Action=srchrtrv&DocNm=640456&DocType=Customer+Drawing&DocLang=English; ComponentLink1Description: http://www.te.com/commerce/DocumentDelivery/DDEController?Action=srchrtrv&DocNm=640456&DocType=Customer+Drawing&DocLang=English; Supplier Part Number 1: A1921-ND
R5-R7 = R_10K_SMD0603_1%_1/10W: as R1 on sheet [03] - MODULE BLE; Supplier 1: Digi-Key; RoHS: RoHS Compliant; Category: Resistors; Stock 1: 10005000; Pricing 1: 5000=0.00167, 10000=0.00145, 25000=0.00128, 50000=0.00117, 125000=0.00115 (USD); Packaging: Tape & Reel (TR); Part Status: Active; Tolerance: ±1%; Composition: Thick Film; Features: Moisture Resistant; Operating Temperature: -55°C ~ 155°C; Package / Case: 0603 (1608 Metric); Supplier Device Package: 0603; Size / Dimension: 0.063" L x 0.031" W (1.60mm x 0.80mm); Height: 0.022" (0.55mm); Number of Terminations: 2; ComponentLink1URL: http://www.yageo.com/documents/recent/PYu-RC_Group_51_RoHS_L_04.pdf; ComponentLink1Description: http://www.yageo.com/documents/recent/PYu-RC_Group_51_RoHS_L_04.pdf; Supplier Part Number 1: 311-10.0KHRTR-ND; Mounting Type: Surface Mount, MLCC; Applications: General Purpose; Ratings: -; Height - Seated (Max): -; Thickness (Max): 0.037" (0.94mm); Lead Spacing: -; Lead Style: -; ComponentLink2URL: http://datasheets.avx.com/X7RDielectric.pdf; ComponentLink2Description: http://datasheets.avx.com/X7RDielectric.pdf
R8 = R_1K2_SMD0603_1%_1/10W: RES SMD 1.2K OHM 1% 1/10W 0603; Manufacturer: Yageo; Manufacturer Part Number: RC0603FR-071K2L; Power (Watts): 0.1W, 1/10W; Temperature Coefficient: ±100ppm/°C; Supplier 1: Digi-Key; RoHS: RoHS Compliant; Category: Resistors; Stock 1: 560000; Pricing 1: 5000=0.00167, 10000=0.00145, 25000=0.00128, 50000=0.00117, 125000=0.00115 (USD); Packaging: Tape & Reel (TR); Part Status: Active; Tolerance: ±1%; Composition: Thick Film; Features: Moisture Resistant; Operating Temperature: -55°C ~ 155°C; Package / Case: 0603 (1608 Metric); Supplier Device Package: 0603; Size / Dimension: 0.063" L x 0.031" W (1.60mm x 0.80mm); Height: 0.022" (0.55mm); Number of Terminations: 2; ComponentLink1URL: http://www.yageo.com/documents/recent/PYu-RC_Group_51_RoHS_L_04.pdf; ComponentLink1Description: http://www.yageo.com/documents/recent/PYu-RC_Group_51_RoHS_L_04.pdf; Supplier Part Number 1: 311-1.20KHRTR-ND
U3 = POWER_LDO_LD3985_3.3V_SOT-23-5: IC REG LDO 3.3V 0.15A SOT23-5; Manufacturer: STMicroelectronics; Manufacturer Part Number: LD3985M33R; Regulator Topology: Positive Fixed; Current - Output: 150mA; Voltage - Dropout (Typical): 0.06V @ 150mA; Number of Regulators: 1; Voltage - Input: Up to 6V; Current - Limit (Min): 300mA; Supplier 1: Digi-Key; RoHS: RoHS Compliant; Category: Integrated Circuits (ICs); Stock 1: 6000; Pricing 1: 3000=0.2294, 6000=0.2146, 15000=0.1998, 30000=0.18944, 75000=0.185, 150000=0.1776 (USD); Packaging: Tape & Reel (TR); Part Status: Active; Voltage - Output: 3.3V; Operating Temperature: -40°C ~ 125°C; Mounting Type: Surface Mount; Package / Case: SC-74A, SOT-753; Supplier Device Package: SOT-23-5; ComponentLink1URL: http://www.st.com/web/en/resource/technical/document/datasheet/CD00003395.pdf; ComponentLink1Description: http://www.st.com/web/en/resource/technical/document/datasheet/CD00003395.pdf; Supplier Part Number 1: 497-3504-2-ND
U4 = POWER_CHARGE_TP4056_4.2V_SOP8: IC CHARGR BATTERY L-ION  SOP8; Manufacturer: NanJing; Battery Chemistry: Lithium-Ion; Number of Cells: 1; Current - Charging: Constant - Programmable; Programmable Features: Timer; Fault Protection: Over Current, Over Temperature; Charge Current - Max: 700mA; Battery Pack Voltage: 4.2V; Voltage - Supply (Max): 8V; Supply: TAOBAO; Manufacturer Part Number: TP4056; RoHS: RoHS Compliant; Category: Integrated Circuits (ICs); Stock 1: 0; Pricing 1: 500=1.76 (USD); Packaging: Tape & Reel (TR); Part Status: Active; Interface: -; Operating Temperature: -40°C ~ 85°C (TA); Package / Case: SOP8; Supplier Device Package: SOP8; ComponentLink1URL: http://www.linear.com/docs/3854; ComponentLink1Description: http://www.linear.com/docs/3854

## Sheet [06] - PERIPHERAL.SchDoc
size A3; CompanyName: FPT-FTI copporation; Address1: FPT Building Duy Tan; Address2: Floor 4,; DocumentNumber: 6; SheetNumber: 6; SheetTotal: 8; NameAuthor: Angle Vu
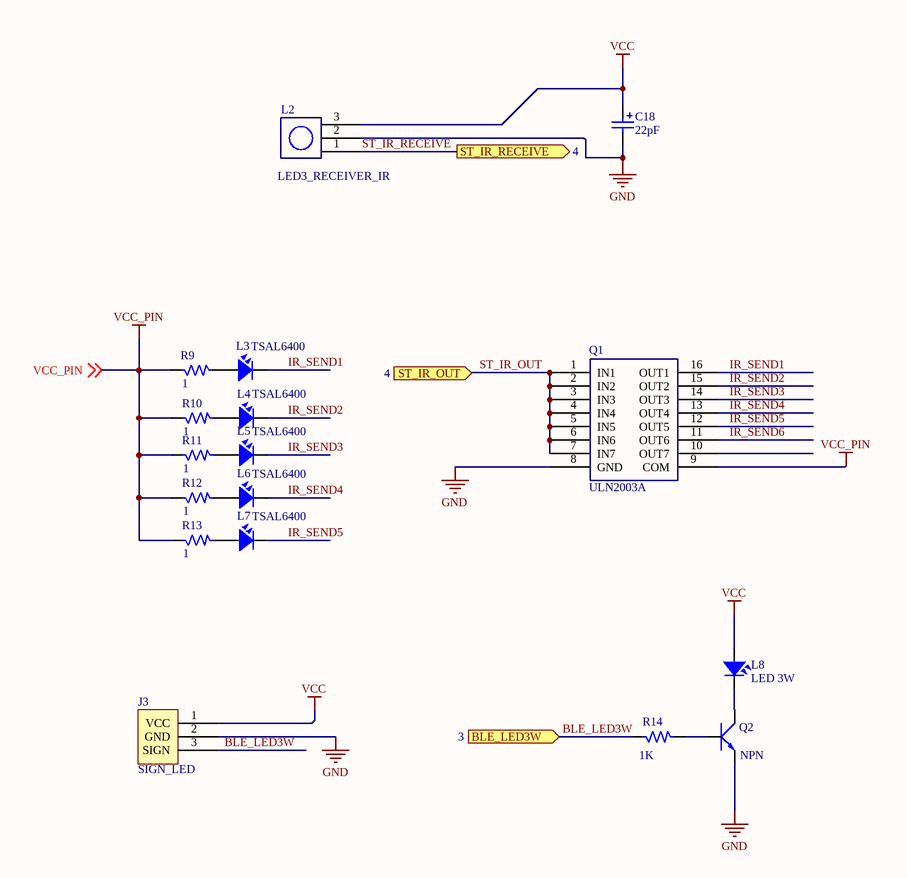
[diagram p6: [06] - PERIPHERAL.SchDoc]

### Parts
C18  Capacitance: 22pF  [CAP_SMD0603]  (hidden comment: C_22pF_SMD0603_CERAMIC_50V)
J3  SIGN_LED  [HEADER3_SIGN_LED]
L2  LED3_RECEIVER_IR  [LED3_IR_RECEIVER]
L3  TSAL6400  [LED2_IR_TRANSMITOR]
L4  TSAL6400  [LED2_IR_TRANSMITOR]
L5  TSAL6400  [LED2_IR_TRANSMITOR]
L6  TSAL6400  [LED2_IR_TRANSMITOR]
L7  TSAL6400  [LED2_IR_TRANSMITOR]
L8  LED 3W  [LED2_IR_TRANSMITOR]
Q1  ULN2003A  [TRAN7_ULN2003_16SOIC]
Q2  NPN  [TRAN-NPN-SMD]
R9  Resistance (Ohms): 1  [RES_SMD0603]  (hidden comment: R_1OhM_SMD0603_1%_1/4W)
R10  Resistance (Ohms): 1  [RES_SMD0603]  (hidden comment: R_1OhM_SMD0603_1%_1/4W)
R11  Resistance (Ohms): 1  [RES_SMD0603]  (hidden comment: R_1OhM_SMD0603_1%_1/4W)
R12  Resistance (Ohms): 1  [RES_SMD0603]  (hidden comment: R_1OhM_SMD0603_1%_1/4W)
R13  Resistance (Ohms): 1  [RES_SMD0603]  (hidden comment: R_1OhM_SMD0603_1%_1/4W)
R14  Resistance (Ohms): 1K  [RES_SMD0603]  (hidden comment: R_1K_SMD0603_1%_1/10W)

### Ports
BLE_LED3W (in, see 3), ST_IR_OUT (in, see 4), ST_IR_RECEIVE (out, see 4)

### Nets
GND: C18.2 J3.2(GND) L2.2(GND) Q1.8(GND) Q2.2(E)
VCC: C18.1 J3.1(VCC) L2.3(VCC) L8.1
VCC_PIN: Q1.9(COM) R9.1 R10.1 R11.1 R12.1 R13.1 ; off-sheet VCC_PIN
BLE_LED3W: J3.3(SIGN) R14.1 ; port BLE_LED3W
IR_SEND1: L3.2 Q1.16(OUT1)
IR_SEND2: L4.2 Q1.15(OUT2)
IR_SEND3: L5.2 Q1.14(OUT3)
IR_SEND4: L6.2 Q1.13(OUT4)
IR_SEND5: L7.2 Q1.12(OUT5)
IR_SEND6: Q1.11(OUT6)
ST_IR_OUT: Q1.1(IN1) Q1.2(IN2) Q1.3(IN3) Q1.4(IN4) Q1.5(IN5) Q1.6(IN6) Q1.7(IN7) ; port ST_IR_OUT
ST_IR_RECEIVE: L2.1(OUT) ; port ST_IR_RECEIVE
NetL3_1: L3.1 R9.2
NetL4_1: L4.1 R10.2
NetL5_1: L5.1 R11.2
NetL6_1: L6.1 R12.2
NetL7_1: L7.1 R13.2
NetL8_2: L8.2 Q2.3(C)
NetQ2_1: Q2.1(B) R14.2

Not connected (* = marked no-connect by the designer): Q1 10(OUT7)

### Notes on the sheet
- Designed By
- Checked By
- Company:
- Size:
- A3
- Address:
- Sheet:
- /

### Library data of the parts
C18 = C_22pF_SMD0603_CERAMIC_50V: CAP CER 22PF 50V NP0 0603; Manufacturer: Murata Electronics North America; Manufacturer Part Number: GQM1885C1H220JB01D; Tolerance: ±5%; Temperature Coefficient: C0G, NP0; Supplier 1: Digi-Key; RoHS: RoHS Compliant; Category: Capacitors; Stock 1: 40000; Pricing 1: 4000=0.168, 8000=0.1568, 12000=0.154, 28000=0.1512, 100000=0.14 (USD); Packaging: Tape & Reel (TR); Part Status: Active; Voltage - Rated: 50V; Mounting Type: Surface Mount, MLCC; Operating Temperature: -55°C ~ 125°C; Applications: RF, Microwave, High Frequency; Ratings: -; Package / Case: 0603 (1608 Metric); Size / Dimension: 0.063" L x 0.031" W (1.60mm x 0.80mm); Height - Seated (Max): -; Thickness (Max): 0.035" (0.90mm); Lead Spacing: -; Features: High Q, Low Loss; Lead Style: -; ComponentLink1URL: http://www.murata.com/~/media/webrenewal/support/library/catalog/products/capacitor/mlcc/c02e.pdf; ComponentLink1Description: http://www.murata.com/~/media/webrenewal/support/library/catalog/products/capacitor/mlcc/c02e.pdf; Supplier Part Number 1: 490-3575-2-ND
J3 = HEADER3_SIGN_LED_HOLE2.54: CONN HEADER VERT 3POS .100 TIN; Manufacturer: TE Connectivity AMP Connectors; Manufacturer Part Number: 640456-3; Connector Type: Header, Unshrouded; Number of Positions: 3; Number of Positions Loaded: All; Pitch: 0.100" (2.54mm); Supplier 1: Digi-Key; RoHS: RoHS Compliant; Category: Connectors, Interconnects; Stock 1: 100299; Pricing 1: 1=0.13, 10=0.119, 100=0.095, 500=0.088, 1000=0.081, 2000=0.075, 5000=0.07, 10000=0.056, 25000=0.052 (USD); Packaging: Bulk; Part Status: Active; Contact Type: Male Pin; Number of Rows: 1; Row Spacing: -; Contact Mating Length: 0.295" (7.49mm); Mounting Type: Through Hole; Termination: Solder; Fastening Type: Friction Lock; Features: -; Contact Finish: Tin; Contact Finish Thickness: -; Color: Natural; ComponentLink1URL: http://www.te.com/commerce/DocumentDelivery/DDEController?Action=srchrtrv&DocNm=640456&DocType=Customer+Drawing&DocLang=English; ComponentLink1Description: http://www.te.com/commerce/DocumentDelivery/DDEController?Action=srchrtrv&DocNm=640456&DocType=Customer+Drawing&DocLang=English; Supplier Part Number 1: A19470-ND
L2 = LED3_RECEIVER_IR_HOLE_38KHz_3V: RECEIVER IR REM CTRL 3V 38KHZ; Manufacturer: Sharp Microelectronics; Manufacturer Part Number: GP1UE261XKVF; Sensing Distance: 10m; B.P.F. Center Frequency: 38.0kHz; Voltage - Supply: 2.7 V ~ 5.5 V; Current - Supply: 400µA; Supplier 1: Digi-Key; RoHS: RoHS Compliant; Category: Sensors, Transducers; Stock 1: 4398; Pricing 1: 1=1.3, 10=1.053, 25=0.81, 100=0.729, 250=0.648, 500=0.5508, 1000=0.4536, 2500=0.432 (USD); Part Status: Active; Orientation: Top View; Mounting Type: Through Hole; Operating Temperature: -10°C ~ 70°C (TA); ComponentLink1URL: http://www.sharpsma.com/ru/download/GP1UE26XK0VF-Epdf; ComponentLink1Description: http://www.sharpsma.com/ru/download/GP1UE26XK0VF-Epdf; Supplier Part Number 1: 425-2883-ND
L3-L8 = LED2_TRANSMITER_IR_TSAL6400_HOLE_5MM: EMITTER IR 940NM 100MA RADIAL; Manufacturer: Vishay Semiconductor Opto Division; Type: Infrared (IR); Radiant Intensity (Ie) Min @ If: 25mW/sr @ 100mA; Voltage - Forward (Vf) (Typ): 1.35V; Viewing Angle: 50°; Supplier 1: Digi-Key; Manufacturer Part Number: TSAL6400; RoHS: RoHS Compliant; Category: Optoelectronics; Stock 1: 12590; Pricing 1: 1=0.57, 10=0.412, 25=0.336, 100=0.2688, 250=0.2268, 500=0.1932, 1000=0.1512, 2500=0.1386, 5000=0.126 (USD); Packaging: Bulk; Part Status: Active; Current - DC Forward (If) (Max): 100mA; Wavelength: 940nm; Orientation: Top View; Operating Temperature: -40°C ~ 85°C (TA); Mounting Type: Through Hole; Package / Case: Radial, 5mm Dia (T 1 3/4); ComponentLink1URL: http://www.vishay.com/docs/81011/tsal6400.pdf; ComponentLink1Description: http://www.vishay.com/docs/81011/tsal6400.pdf; Supplier Part Number 1: 751-1205-ND
Q1 = TRAN_7NPN_SMD_16SOIC: TRANS 7NPN DARL 50V 0.5A 16SO; Manufacturer: Texas Instruments; Manufacturer Part Number: ULN2003ADR; Transistor Type: 7 NPN Darlington; Current - Collector (Ic) (Max): 500mA; Vce Saturation (Max) @ Ib, Ic: 1.6V @ 500µA, 350mA; Supplier 1: Digi-Key; RoHS: RoHS Compliant; Category: Discrete Semiconductor Products; Stock 1: 35000; Pricing 1: 2500=0.186, 5000=0.174, 12500=0.162, 25000=0.1536, 62500=0.15 (USD); Packaging: Tape & Reel (TR); Part Status: Active; Voltage - Collector Emitter Breakdown (Max): 50V; Current - Collector Cutoff (Max): -; DC Current Gain (hFE) (Min) @ Ic, Vce: -; Power - Max: -; Frequency - Transition: -; Mounting Type: Surface Mount; Package / Case: 16-SOIC (0.154", 3.90mm Width); Supplier Device Package: 16-SOIC; ComponentLink1URL: http://www.ti.com/lit/ds/symlink/uln2003a.pdf; ComponentLink1Description: http://www.ti.com/lit/ds/symlink/uln2003a.pdf; Supplier Part Number 1: 296-1368-2-ND
Q2 = TRAN_NPN_SMD_SOT23_0.2A_40V: TRANS NPN 40V 0.2A SOT23; Manufacturer: ON Semiconductor; Manufacturer Part Number: MMBT3904LT1G; Current - Collector (Ic) (Max): 200mA; Vce Saturation (Max) @ Ib, Ic: 300mV @ 5mA, 50mA; DC Current Gain (hFE) (Min) @ Ic, Vce: 100 @ 10mA, 1V; Power - Max: 300mW; Frequency - Transition: 300MHz; Supplier 1: Digi-Key; RoHS: RoHS Compliant; Category: Discrete Semiconductor Products; Stock 1: 540000; Pricing 1: 3000=0.01913, 6000=0.01725, 15000=0.015, 30000=0.0135, 75000=0.012, 150000=0.00998 (USD); Packaging: Tape & Reel (TR); Part Status: Active; Transistor Type: NPN; Voltage - Collector Emitter Breakdown (Max): 40V; Current - Collector Cutoff (Max): -; Mounting Type: Surface Mount; Package / Case: TO-236-3, SC-59, SOT-23-3; Supplier Device Package: SOT-23-3 (TO-236); ComponentLink1URL: http://www.onsemi.com/pub_link/Collateral/MMBT3904LT1-D.PDF; ComponentLink1Description: http://www.onsemi.com/pub_link/Collateral/MMBT3904LT1-D.PDF; Supplier Part Number 1: MMBT3904LT1GOSTR-ND
R9-R13 = R_1OhM_SMD0603_1%_1/4W: RES SMD 1 OHM 1% 1/4W 0603; Manufacturer: Panasonic Electronic Components; Manufacturer Part Number: ERJ-3BQF1R0V; Power (Watts): 0.25W, 1/4W; Temperature Coefficient: ±200ppm/°C; Supplier 1: Digi-Key; RoHS: RoHS Compliant; Category: Resistors; Stock 1: 5000; Pricing 1: 5000=0.0408, 10000=0.03808, 25000=0.03618, 50000=0.03544, 125000=0.03468 (USD); Packaging: Tape & Reel (TR); Part Status: Active; Tolerance: ±1%; Composition: Thick Film; Features: Automotive AEC-Q200, Current Sense; Operating Temperature: -55°C ~ 125°C; Package / Case: 0603 (1608 Metric); Supplier Device Package: 0603; Size / Dimension: 0.063" L x 0.031" W (1.60mm x 0.80mm); Height: 0.022" (0.55mm); Number of Terminations: 2; ComponentLink1URL: https://industrial.panasonic.com/cdbs/www-data/pdf/RDA0000/AOA0000C239.pdf; ComponentLink1Description: https://industrial.panasonic.com/cdbs/www-data/pdf/RDA0000/AOA0000C239.pdf; Supplier Part Number 1: P17371TR-ND
R14 = R_1K_SMD0603_1%_1/10W: RES SMD 1K OHM 1% 1/10W 0603; Manufacturer: Yageo; Manufacturer Part Number: RC0603FR-071KL; Power (Watts): 0.1W, 1/10W; Temperature Coefficient: ±100ppm/°C; Supplier 1: Digi-Key; RoHS: RoHS Compliant; Category: Resistors; Stock 1: 6725000; Pricing 1: 5000=0.00167, 10000=0.00145, 25000=0.00128, 50000=0.00117, 125000=0.00115 (USD); Packaging: Tape & Reel (TR); Part Status: Active; Tolerance: ±1%; Composition: Thick Film; Features: Moisture Resistant; Operating Temperature: -55°C ~ 155°C; Package / Case: 0603 (1608 Metric); Supplier Device Package: 0603; Size / Dimension: 0.063" L x 0.031" W (1.60mm x 0.80mm); Height: 0.022" (0.55mm); Number of Terminations: 2; ComponentLink1URL: http://www.yageo.com/documents/recent/PYu-RC_Group_51_RoHS_L_04.pdf; ComponentLink1Description: http://www.yageo.com/documents/recent/PYu-RC_Group_51_RoHS_L_04.pdf; Supplier Part Number 1: 311-1.00KHRTR-ND

## Sheet [07] - DOC REVISION HISTORY.SchDoc
size A3; DocumentNumber: 3; SheetNumber: 3; SheetTotal: 4; NameAuthor: Angle Vu
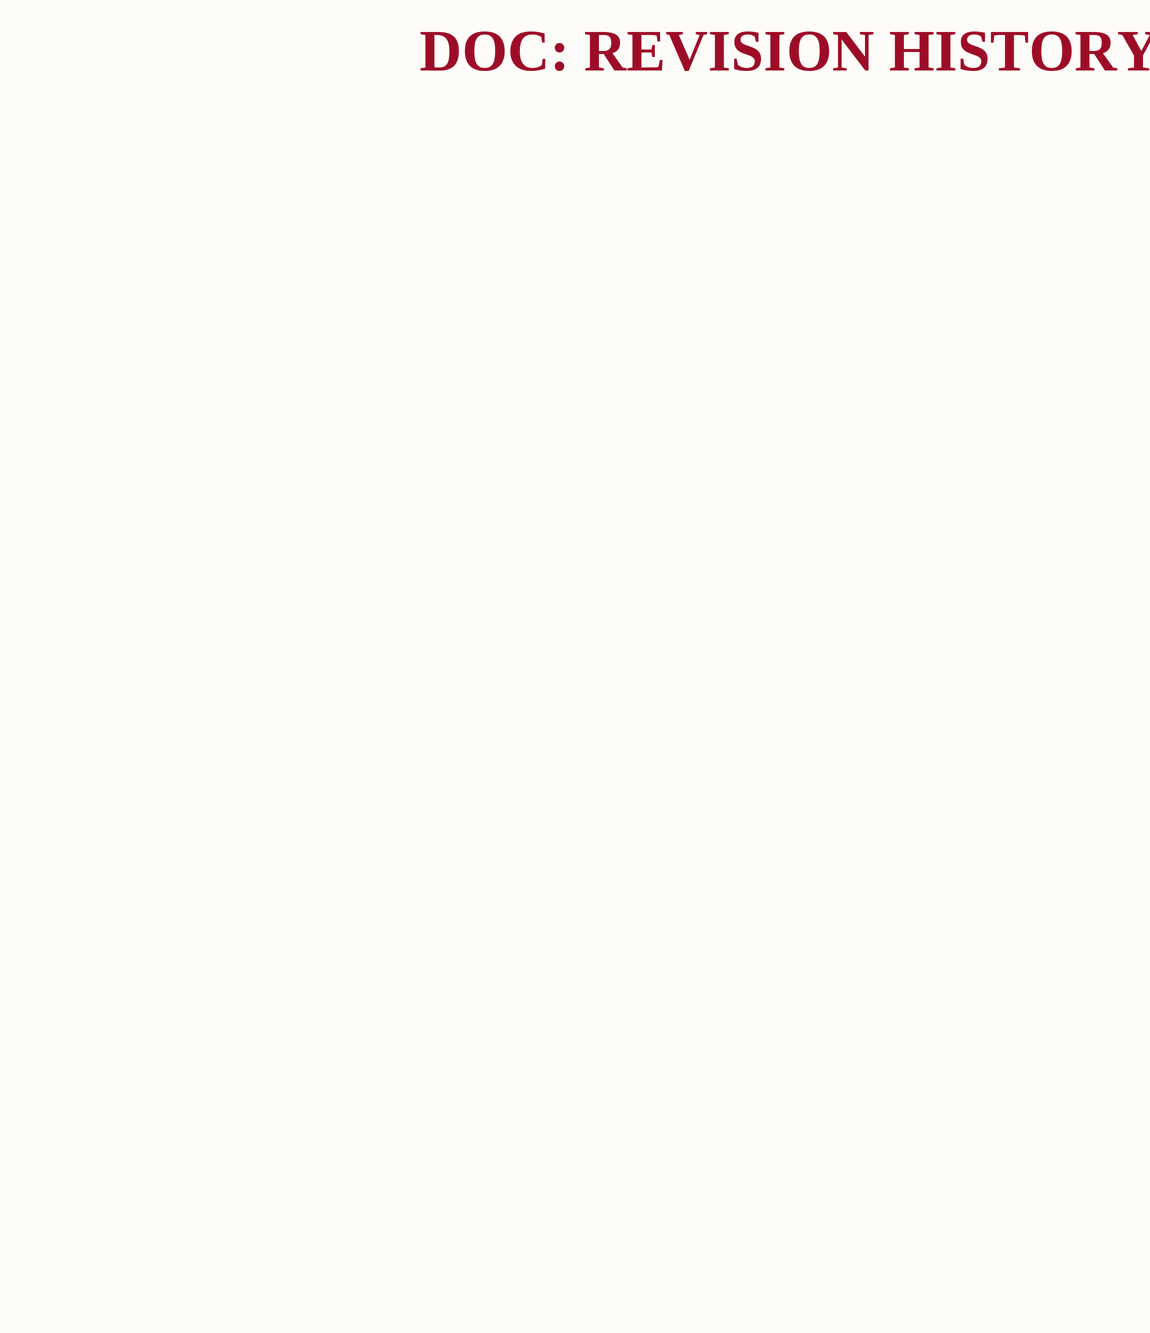
[diagram p7: [07] - DOC REVISION HISTORY.SchDoc]

### Notes on the sheet
- DOC: REVISION HISTORY
- CLOCKS (CPU & PCIE)
- Designed By
- Checked By
- Company:
- Size:
- A3
- Address:
- Sheet:
- /

## Nets that join several sheets
GND: [03] - MODULE BLE (9 pins), [04] - MCU STM32 (11 pins), [05] - POWER (9 pins), [06] - PERIPHERAL (5 pins)
VCC: [03] - MODULE BLE (9 pins), [04] - MCU STM32 (14 pins), [05] - POWER (C11.1 C15.1 R5.2 U3.5), [06] - PERIPHERAL (C18.1 J3.1 L2.3 L8.1)
VCC_PIN: [05] - POWER (C16.1 J1.2 J2.1 U4.5), [06] - PERIPHERAL (6 pins)
BLE_CHRG: [03] - MODULE BLE (U1.12), [05] - POWER (D5.2 U4.7)
BLE_LED3W: [03] - MODULE BLE (U1.31), [06] - PERIPHERAL (J3.3 R14.1)
BLE_RESET_ST: [03] - MODULE BLE (U1.4), [04] - MCU STM32 (H3.5 U2.7)
BLE_STATUS_ST: [03] - MODULE BLE (U1.15), [04] - MCU STM32 (U2.34)
BLE_STATUS_ST1: [03] - MODULE BLE (U1.27), [04] - MCU STM32 (U2.56)
BLE_STATUS_ST2: [03] - MODULE BLE (U1.28), [04] - MCU STM32 (U2.57)
BLE_STATUS_ST3: [03] - MODULE BLE (U1.29), [04] - MCU STM32 (U2.58)
BLE_STDBY: [03] - MODULE BLE (U1.11), [05] - POWER (D6.2 U4.6)
BLE_WAKEUP_ST: [03] - MODULE BLE (U1.16), [04] - MCU STM32 (U2.35)
ST_IR_OUT: [04] - MCU STM32 (U2.23), [06] - PERIPHERAL (7 pins)
ST_IR_RECEIVE: [04] - MCU STM32 (U2.39), [06] - PERIPHERAL (L2.1)
ST_RX: [03] - MODULE BLE (H2.4), [04] - MCU STM32 (U2.17)
ST_TX: [03] - MODULE BLE (H2.2), [04] - MCU STM32 (U2.16)